# Altium project Arduino - FPGA Development Board.PrjPcb (part 1 of 2)
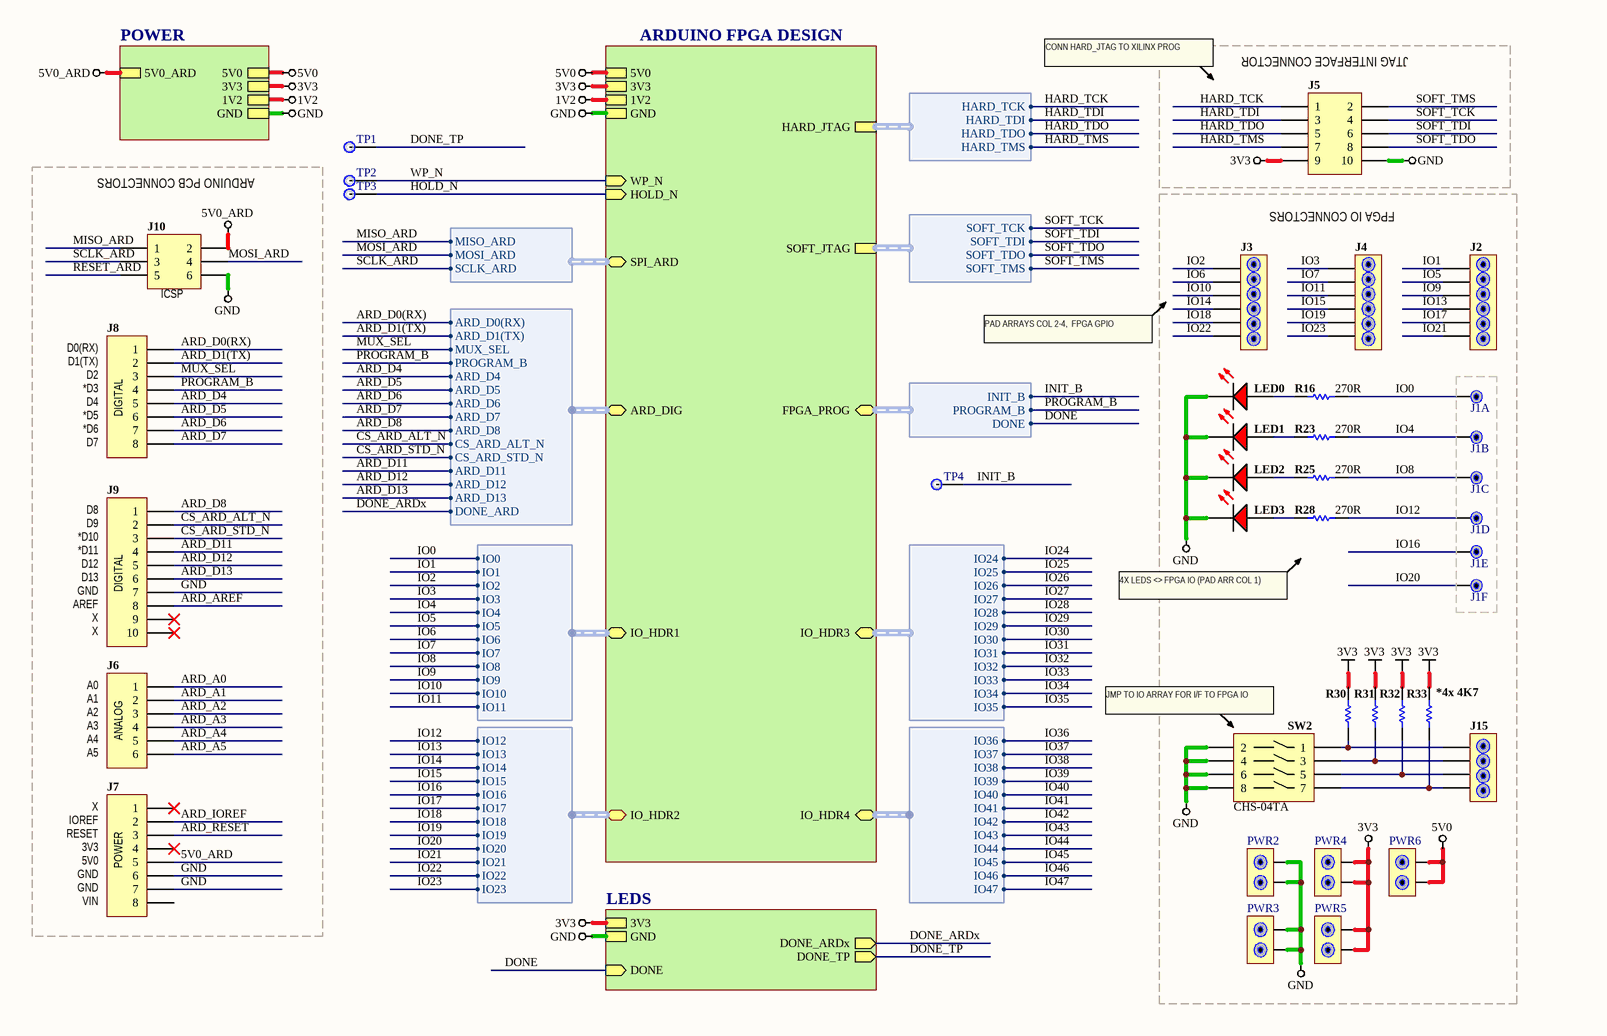
[diagram p0: Arduino FPGA Top-Level Interface.SchDoc]
12 sheets, 121 parts. Net scope: hierarchical (ports join the sheet entries above them; power ports are global).
Board file: Arduino_FPGA_Shield.PcbDoc
Sheets:
  Arduino FPGA Top-Level Interface.SchDoc
    ARDUINO FPGA DESIGN = Arduino FPGA Design.SchDoc
      FLASH_MEMORY = Flash - S25FL216K0PMFI041.SchDoc
      FPGA_SUBSYSTEM = FPGA - XC6SLX9-2TQG144C.schdoc
        U_FPGA - Decoupling = FPGA - Decoupling.SchDoc
      SPI MUX = Arduino FPGA SPI MUX.SchDoc
      SRAM0 = SRAM0 - IS61WV12816DBLL-10BLI.SchDoc
      LEVEL_XSLATE = Arduino FPGA Level Translation.SchDoc
    POWER = Power - 5V0.SchDoc
      Power - 3V3 = Power - 3V3.SchDoc
      Power - 1V2 = Power - 1V2.SchDoc
    LEDS = LEDS - Status.SchDoc

## Sheet Arduino FPGA Top-Level Interface.SchDoc
size A4

### Parts
J1  HDR1X6X1  [HDR1X6]  (value not drawn)  (parts A,B,C,D,E,F of 6)
J2  6-POS VERTICAL HEADER  [HDR1X6]  (value not drawn)
J3  6-POS VERTICAL HEADER  [HDR1X6]  (value not drawn)
J4  6-POS VERTICAL HEADER  [HDR1X6]  (value not drawn)
J5  Header 5X2  [HDR2X5]  (value not drawn)
J6  Header 6  [1X06]  (value not drawn)
J7  Header 8  [1X08]  (value not drawn)
J8  Header 8  [1X08]  (value not drawn)
J9  Header 10  [1X10@1]  (value not drawn)
J10  Header 3X2  [2X03]  (value not drawn)
J15  4-POS VERTICAL HEADER  [HDR1X4]  (value not drawn)
LED0  0402-LED-RED  [LED_0402]  (value not drawn)
LED1  0402-LED-RED  [LED_0402]  (value not drawn)
LED2  0402-LED-RED  [LED_0402]  (value not drawn)
LED3  0402-LED-RED  [LED_0402]  (value not drawn)
PWR2  Jumper  [JMP1X2]  (value not drawn)
PWR3  Jumper  [JMP1X2]  (value not drawn)
PWR4  Jumper  [JMP1X2]  (value not drawn)
PWR5  Jumper  [JMP1X2]  (value not drawn)
PWR6  Jumper  [JMP1X2]  (value not drawn)
R16  value 270R  [RESC0402(1005)40_L]  (hidden comment: 270R 1 0402)
R23  value 270R  [RESC0402(1005)40_L]  (hidden comment: 270R 1 0402)
R25  value 270R  [RESC0402(1005)40_L]  (hidden comment: 270R 1 0402)
R28  value 270R  [RESC0402(1005)40_L]  (hidden comment: 270R 1 0402)
R30  4K7 1 0402  [RESC0402(1005)40_L]  (value not drawn)
R31  4K7 1 0402  [RESC0402(1005)40_L]  (value not drawn)
R32  4K7 1 0402  [RESC0402(1005)40_L]  (value not drawn)
R33  4K7 1 0402  [RESC0402(1005)40_L]  (value not drawn)
SW2  CHS-04TA  [CHS-04A1]
TP1  TESTPOINT_TH  [TESTPOINT_TH]  (value not drawn)
TP2  TESTPOINT_TH  [TESTPOINT_TH]  (value not drawn)
TP3  TESTPOINT_TH  [TESTPOINT_TH]  (value not drawn)
TP4  TESTPOINT_TH  [TESTPOINT_TH]  (value not drawn)

### Blocks framed on the sheet
JTAG INTERFACE CONNECTOR: J5
ARDUINO PCB CONNECTORS: J6-J10
FPGA IO CONNECTORS: J1-J4 J15 LED0-LED3 PWR2-PWR6 R16 R23 R25 R28 R30-R33 SW2

### Sub-sheets
ARDUINO FPGA DESIGN = Arduino FPGA Design.SchDoc: 3V3, GND, 1V2, HARD_JTAG (harness HARD_JTAG), SOFT_JTAG (harness SOFT_JTAG), WP_N (in), HOLD_N (in), IO_HDR2 (harness IO_HDR2), IO_HDR3 (harness IO_HDR3), IO_HDR4 (harness IO_HDR4), IO_HDR1 (harness IO_HDR1), FPGA_PROG (harness FPGA_PROGRAM), SPI_ARD (harness SPI_ARD), 5V0, ARD_DIG (harness ARD_DIG)
LEDS = LEDS - Status.SchDoc: GND, DONE (in), DONE_ARDx (out), DONE_TP (out), 3V3
POWER = Power - 5V0.SchDoc: 5V0, 3V3, 1V2, GND, 5V0_ARD

### Harnesses
HARD_JTAG: HARD_TCK, HARD_TDI, HARD_TDO, HARD_TMS
SOFT_JTAG: SOFT_TCK, SOFT_TDI, SOFT_TDO, SOFT_TMS
FPGA_PROGRAM: INIT_B, PROGRAM_B, DONE
SPI_ARD: MISO_ARD, MOSI_ARD, SCLK_ARD
IO_HDR1: IO0, IO1, IO2, IO3, IO4, IO5, IO6, IO7, IO8, IO9, IO10, IO11
IO_HDR3: IO24, IO25, IO26, IO27, IO28, IO29, IO30, IO31, IO32, IO33, IO34, IO35
IO_HDR4: IO36, IO37, IO38, IO39, IO40, IO41, IO42, IO43, IO44, IO45, IO46, IO47
IO_HDR2: IO12, IO13, IO16, IO17, IO18, IO19, IO20, IO21, IO22, IO23, IO14, IO15
ARD_DIG: ARD_D0(RX), ARD_D1(TX), MUX_SEL, PROGRAM_B, ARD_D4, ARD_D5, ARD_D6, ARD_D7, ARD_D8, CS_ARD_ALT_N, CS_ARD_STD_N, ARD_D11, ARD_D12, ARD_D13, DONE_ARD

### Nets
1V2: sheet ARDUINO FPGA DESIGN/1V2, sheet POWER/1V2
3V3: J5.9 PWR4.1 PWR4.2 PWR5.1 PWR5.2 R30.2 R31.2 R32.2 R33.2 ; sheet ARDUINO FPGA DESIGN/3V3, sheet POWER/3V3, sheet LEDS/3V3
5V0: PWR6.1 PWR6.2 ; sheet ARDUINO FPGA DESIGN/5V0, sheet POWER/5V0
5V0_ARD: J7.5 ; sheet POWER/5V0_ARD
GND: J5.10 J7.6 J7.7 J9.7 J10.6 LED0.2(K) LED1.2(K) LED2.2(K) LED3.2(K) PWR2.1 PWR2.2 PWR3.1 PWR3.2 SW2.2 SW2.4 SW2.6 SW2.8 ; sheet ARDUINO FPGA DESIGN/GND, sheet POWER/GND, sheet LEDS/GND
ARD_A0: J6.1
ARD_A1: J6.2
ARD_A2: J6.3
ARD_A3: J6.4
ARD_A4: J6.5
ARD_A5: J6.6
ARD_AREF: J9.8
ARD_D0(RX): J8.1 ; sheet ARDUINO FPGA DESIGN/ARD_DIG.ARD_D0(RX)
ARD_D1(TX): J8.2 ; sheet ARDUINO FPGA DESIGN/ARD_DIG.ARD_D1(TX)
ARD_D4: J8.5 ; sheet ARDUINO FPGA DESIGN/ARD_DIG.ARD_D4
ARD_D5: J8.6 ; sheet ARDUINO FPGA DESIGN/ARD_DIG.ARD_D5
ARD_D6: J8.7 ; sheet ARDUINO FPGA DESIGN/ARD_DIG.ARD_D6
ARD_D7: J8.8 ; sheet ARDUINO FPGA DESIGN/ARD_DIG.ARD_D7
ARD_D8: J9.1 ; sheet ARDUINO FPGA DESIGN/ARD_DIG.ARD_D8
ARD_D11: J9.4 ; sheet ARDUINO FPGA DESIGN/ARD_DIG.ARD_D11
ARD_D12: J9.5 ; sheet ARDUINO FPGA DESIGN/ARD_DIG.ARD_D12
ARD_D13: J9.6 ; sheet ARDUINO FPGA DESIGN/ARD_DIG.ARD_D13
ARD_IOREF: J7.2
ARD_RESET: J7.3
CS_ARD_ALT_N: J9.2 ; sheet ARDUINO FPGA DESIGN/ARD_DIG.CS_ARD_ALT_N
CS_ARD_STD_N: J9.3 ; sheet ARDUINO FPGA DESIGN/ARD_DIG.CS_ARD_STD_N
DONE: sheet LEDS/DONE, sheet ARDUINO FPGA DESIGN/FPGA_PROG.DONE
DONE_ARDx: sheet LEDS/DONE_ARDx, sheet ARDUINO FPGA DESIGN/ARD_DIG.DONE_ARD
DONE_TP: TP1.1 ; sheet LEDS/DONE_TP
HARD_TCK: J5.1 ; sheet ARDUINO FPGA DESIGN/HARD_JTAG.HARD_TCK
HARD_TDI: J5.3 ; sheet ARDUINO FPGA DESIGN/HARD_JTAG.HARD_TDI
HARD_TDO: J5.5 ; sheet ARDUINO FPGA DESIGN/HARD_JTAG.HARD_TDO
HARD_TMS: J5.7 ; sheet ARDUINO FPGA DESIGN/HARD_JTAG.HARD_TMS
HOLD_N: TP3.1 ; sheet ARDUINO FPGA DESIGN/HOLD_N
INIT_B: TP4.1 ; sheet ARDUINO FPGA DESIGN/FPGA_PROG.INIT_B
IO0: J1.1 R16.2 ; sheet ARDUINO FPGA DESIGN/IO_HDR1.IO0
IO1: J2.1 ; sheet ARDUINO FPGA DESIGN/IO_HDR1.IO1
IO2: J3.1 ; sheet ARDUINO FPGA DESIGN/IO_HDR1.IO2
IO3: J4.1 ; sheet ARDUINO FPGA DESIGN/IO_HDR1.IO3
IO4: J1.2 R23.2 ; sheet ARDUINO FPGA DESIGN/IO_HDR1.IO4
IO5: J2.2 ; sheet ARDUINO FPGA DESIGN/IO_HDR1.IO5
IO6: J3.2 ; sheet ARDUINO FPGA DESIGN/IO_HDR1.IO6
IO7: J4.2 ; sheet ARDUINO FPGA DESIGN/IO_HDR1.IO7
IO8: J1.3 R25.2 ; sheet ARDUINO FPGA DESIGN/IO_HDR1.IO8
IO9: J2.3 ; sheet ARDUINO FPGA DESIGN/IO_HDR1.IO9
IO10: J3.3 ; sheet ARDUINO FPGA DESIGN/IO_HDR1.IO10
IO11: J4.3 ; sheet ARDUINO FPGA DESIGN/IO_HDR1.IO11
IO12: J1.4 R28.2 ; sheet ARDUINO FPGA DESIGN/IO_HDR2.IO12
IO13: J2.4 ; sheet ARDUINO FPGA DESIGN/IO_HDR2.IO13
IO14: J3.4 ; sheet ARDUINO FPGA DESIGN/IO_HDR2.IO14
IO15: J4.4 ; sheet ARDUINO FPGA DESIGN/IO_HDR2.IO15
IO16: J1.5 ; sheet ARDUINO FPGA DESIGN/IO_HDR2.IO16
IO17: J2.5 ; sheet ARDUINO FPGA DESIGN/IO_HDR2.IO17
IO18: J3.5 ; sheet ARDUINO FPGA DESIGN/IO_HDR2.IO18
IO19: J4.5 ; sheet ARDUINO FPGA DESIGN/IO_HDR2.IO19
IO20: J1.6 ; sheet ARDUINO FPGA DESIGN/IO_HDR2.IO20
IO21: J2.6 ; sheet ARDUINO FPGA DESIGN/IO_HDR2.IO21
IO22: J3.6 ; sheet ARDUINO FPGA DESIGN/IO_HDR2.IO22
IO23: J4.6 ; sheet ARDUINO FPGA DESIGN/IO_HDR2.IO23
IO31: sheet ARDUINO FPGA DESIGN/IO_HDR3.IO31
IO32: sheet ARDUINO FPGA DESIGN/IO_HDR3.IO32
IO33: sheet ARDUINO FPGA DESIGN/IO_HDR3.IO33
IO34: sheet ARDUINO FPGA DESIGN/IO_HDR3.IO34
IO35: sheet ARDUINO FPGA DESIGN/IO_HDR3.IO35
IO36: sheet ARDUINO FPGA DESIGN/IO_HDR4.IO36
IO37: sheet ARDUINO FPGA DESIGN/IO_HDR4.IO37
IO38: sheet ARDUINO FPGA DESIGN/IO_HDR4.IO38
IO39: sheet ARDUINO FPGA DESIGN/IO_HDR4.IO39
IO40: sheet ARDUINO FPGA DESIGN/IO_HDR4.IO40
IO41: sheet ARDUINO FPGA DESIGN/IO_HDR4.IO41
IO42: sheet ARDUINO FPGA DESIGN/IO_HDR4.IO42
IO43: sheet ARDUINO FPGA DESIGN/IO_HDR4.IO43
IO44: sheet ARDUINO FPGA DESIGN/IO_HDR4.IO44
IO45: sheet ARDUINO FPGA DESIGN/IO_HDR4.IO45
IO46: sheet ARDUINO FPGA DESIGN/IO_HDR4.IO46
IO47: sheet ARDUINO FPGA DESIGN/IO_HDR4.IO47
MISO_ARD: J10.1 ; sheet ARDUINO FPGA DESIGN/SPI_ARD.MISO_ARD
MOSI_ARD: J10.4 ; sheet ARDUINO FPGA DESIGN/SPI_ARD.MOSI_ARD
MUX_SEL: J8.3 ; sheet ARDUINO FPGA DESIGN/ARD_DIG.MUX_SEL
PROGRAM_B: J8.4 ; sheet ARDUINO FPGA DESIGN/FPGA_PROG.PROGRAM_B, sheet ARDUINO FPGA DESIGN/ARD_DIG.PROGRAM_B
RESET_ARD: J10.5
SCLK_ARD: J10.3 ; sheet ARDUINO FPGA DESIGN/SPI_ARD.SCLK_ARD
SOFT_TCK: J5.4 ; sheet ARDUINO FPGA DESIGN/SOFT_JTAG.SOFT_TCK
SOFT_TDI: J5.6 ; sheet ARDUINO FPGA DESIGN/SOFT_JTAG.SOFT_TDI
SOFT_TDO: J5.8 ; sheet ARDUINO FPGA DESIGN/SOFT_JTAG.SOFT_TDO
SOFT_TMS: J5.2 ; sheet ARDUINO FPGA DESIGN/SOFT_JTAG.SOFT_TMS
WP_N: TP2.1 ; sheet ARDUINO FPGA DESIGN/WP_N
NetJ15_1: J15.1 R30.1 SW2.1
NetJ15_2: J15.2 R31.1 SW2.3
NetJ15_3: J15.3 R32.1 SW2.5
NetJ15_4: J15.4 R33.1 SW2.7
NetLED0_1: LED0.1(A) R16.1
NetLED1_1: LED1.1(A) R23.1
NetLED2_1: LED2.1(A) R25.1
NetLED3_1: LED3.1(A) R28.1

Not connected (* = marked no-connect by the designer): J7 1* 4* 8; J9 9* 10*; J10 2

### Notes on the sheet
- CONN HARD_JTAG TO XILINX PROG
- (near J10) ICSP
- (near J8) D0(RX)
- (near J8) D1(TX)
- (near J8) D2
- PAD ARRAYS COL 2-4,  FPGA GPIO
- (near J8) *D3
- (near J8) D4
- (near J8) *D5
- (near J8) *D6
- (near J8) D7
- (near J8) DIGITAL
- (near J9) D8
- (near J9) D9
- (near J9) *D10
- (near J9) *D11
- (near J9) D12
- (near J9) D13
- (near J9) GND
- (near J9) AREF
- (near J9) X
- X
- (near J9) DIGITAL
- 4X LEDS <> FPGA IO (PAD ARR COL 1)
- A0
- (near J6) A1
- (near J6) A2
- (near SW2) JMP TO IO ARRAY FOR I/F TO FPGA IO
- (near R33) *4x 4K7
- (near J6) A3
- (near J6) A4
- A5
- (near J6) ANALOG
- (near J7) IOREF
- (near J7) RESET
- (near J7) 3V3
- (near J7) 5V0
- (near J7) GND
- (near J7) VIN
- (near J7) POWER
- Labels drawn without touching a wire or pin: 5V0_ARD

### Library data of the parts
J1 = HDR1X6X1: Manufacturer_PN: 68000-406HLF; Manufacturer Part Number: 68000-406HLF
J2-J4 = 6-POS-HDR: Manufacturer_PN: 68000-406HLF; Manufacturer Part Number: 68000-406HLF
J5 = Header 5X2: Header, 5-Pin, Dual row; Manufacturer_PN: 67997-210HLF; LatestRevisionDate: 17-Jul-2002; LatestRevisionNote: Re-released for DXP Platform.; Publisher: Altium Limited; Manufacturer Part Number: 67997-210HLF
J6 = Header 6: Header, 6-Pin; Manufacturer_PN: DNP; LatestRevisionDate: 17-Jul-2002; LatestRevisionNote: Re-released for DXP Platform.; Publisher: Altium Limited; Manufacturer Part Number: DNP
J7 J8 = Header 8: Header, 8-Pin; Manufacturer_PN: DNP; LatestRevisionDate: 17-Jul-2002; LatestRevisionNote: Re-released for DXP Platform.; Publisher: Altium Limited; Manufacturer Part Number: DNP
J9 = Header 10: Header, 10-Pin; Manufacturer_PN: DNP; LatestRevisionDate: 17-Jul-2002; LatestRevisionNote: Re-released for DXP Platform.; Publisher: Altium Limited; Manufacturer Part Number: DNP
J10 = Header 3X2: Header, 3-Pin, Dual row; Manufacturer_PN: DNP; LatestRevisionDate: 17-Jul-2002; LatestRevisionNote: Re-released for DXP Platform.; Publisher: Altium Limited; Manufacturer Part Number: DNP
J15 = 4-POS-HDR: Manufacturer_PN: 68000-404HLF; Manufacturer Part Number: 68000-404HLF
LED0-LED3 = CMP-0201-0013: 0402 LED,RED; Manufacturer_PN: LTST-C190KRKT; DefaultDesignator: LED?; Class: Diodes; Current Average (Io): 1.8V; ID: CMP-0201-0013; Sub Class: LED; Reverse Voltage DC (Vr): Red; ComponentLink1Description: Datasheet; ComponentLink1URL: http://optoelectronics.liteon.com/upload/download/DS-22-99-0151/S_110_LTST-C190KRKT.pdf; ComponentLink2Description: Manufacturer; ComponentLink2URL: http://www.liteon.com; Manufacturer Part Number: LTST-C190KRKT
PWR2-PWR6 = JMP1X2: Standard 2 Pin Jumper, 100mil spacing; Manufacturer_PN: M20-9770246; Manufacturer Part Number: M20-9770246
R16 R23 R25 R28 = CMP-0503-0059: 0402 (1005 Metric) 1/16 W 270R 1 Thick Film Chip Resistor; Manufacturer_PN: RC1005F271CS; Case-EIA: 0402; Case-Metric: 1005; Temp Coefficient ppm/°C: ±100; Tolerance %: 1%; Value (Ohms): 270; Power: 1/16 W; ID: CMP-0503-0059; Technology: SMT; Manufacturer Part Number: RC1005F271CS
R30-R33 = 0402 (1005 Metric) 1/16 W 4K7 1 Thick Film Chip Resistor: Manufacturer_PN: CR0402-FX-4701GLFDKR-ND; Case-EIA: 0402; Case-Metric: 1005; Power: 1/16 W; Temp Coefficient ppm/°C: ±100; Tolerance %: 1%; Value (Ohms): 4700; Value: 4K7; Technology: SMT; Manufacturer Part Number: CR0402-FX-4701GLFDKR-ND
SW2 = CHS-04TA: SWITCH DIP 4-POS SLIDE SMD 6V; Manufacturer: Copal Electronics Inc; Circuit: SPST; Number of Positions: 4; Contact Rating @ Voltage: 0.1A @ 6VDC; Actuator Type: Standard; Actuator Level: Flush; Washable: Yes; Supplier 1: Digi-Key; Manufacturer Part Number: CHS-04TA; RoHS: RoHS Compliant; Category: Switches; Stock 1: 2000; Pricing 1: 500=1.33876, 1000=1.1475, 5000=1.05188 (USD); Mounting Type: Surface Mount; Orientation: Top Actuated; ComponentLink1URL: http://copal-electronics.info/en/0008e/0267f.pdf; ComponentLink1Description: http://copal-electronics.info/en/0008e/0267f.pdf; Supplier Part Number 1: 563-1007-2-ND; Manufacturer_PN: CHS-04TA
TP1-TP4 = TESTPOINT_TH: Manufacturer_PN: TESTPOINT; Manufacturer Part Number: TESTPOINT

## Sheet Arduino FPGA Design.SchDoc
size A4
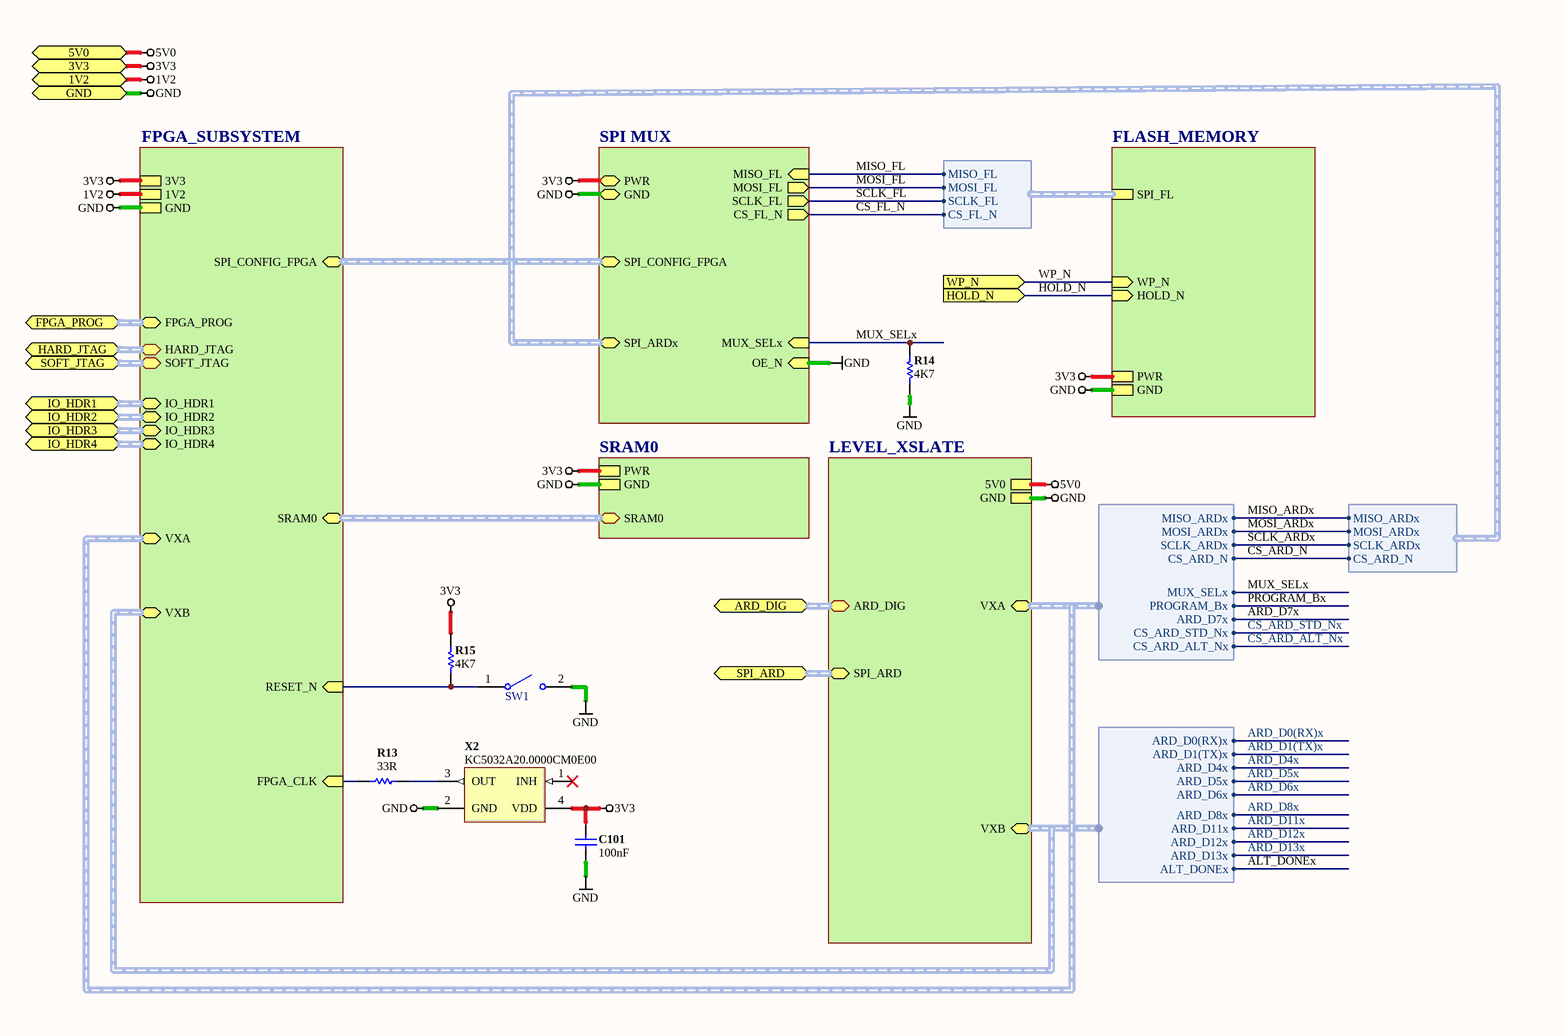
[diagram p1: Arduino FPGA Design.SchDoc]

### Parts
C101  value 100nF  [CAPC0402(1005)60_L]  (hidden comment: CAP 100nF 16V 0402(1005))
R13  value 33R  [RESC0402(1005)40_L]  (hidden comment: 33R 1 0402)
R14  value 4K7  [RESC0402(1005)40_L]  (hidden comment: 4K7 1 0402)
R15  value 4K7  [RESC0402(1005)40_L]  (hidden comment: 4K7 1 0402)
SW1  ADTSM32RVTR  [ADTSM32RVTR]  (value not drawn)
X2  KC5032A20.0000CM0E00  [HOSC-L500HW320H105-4_2]

### Sub-sheets
FLASH_MEMORY = Flash - S25FL216K0PMFI041.SchDoc: SPI_FL (harness SPI_FLASH), PWR, WP_N (in), HOLD_N (in), GND
FPGA_SUBSYSTEM = FPGA - XC6SLX9-2TQG144C.schdoc: 3V3, GND, 1V2, FPGA_CLK (in), HARD_JTAG (harness HARD_JTAG), SOFT_JTAG (harness SOFT_JTAG), IO_HDR3 (harness IO_HDR3), IO_HDR4 (harness IO_HDR4), SPI_CONFIG_FPGA (harness SPI_CONFIG_FPGA), FPGA_PROG (harness FPGA_PROGRAM), IO_HDR1 (harness IO_HDR1), IO_HDR2 (harness IO_HDR2), SRAM0 (harness SRAM0), RESET_N (in), VXA (harness VXA), VXB (harness VXB)
LEVEL_XSLATE = Arduino FPGA Level Translation.SchDoc: GND, 5V0, ARD_DIG (harness ARD_DIG), SPI_ARD (harness SPI_ARD), VXA (harness VXA), VXB (harness VXB)
SPI MUX = Arduino FPGA SPI MUX.SchDoc: MISO_FL (in), MOSI_FL (out), SCLK_FL (out), CS_FL_N (out), OE_N (in), MUX_SELx (in), SPI_CONFIG_FPGA (harness SPI_CONFIG_FPGA), PWR, GND, SPI_ARDx (harness SPI_ARDx)
SRAM0 = SRAM0 - IS61WV12816DBLL-10BLI.SchDoc: PWR, GND, SRAM0 (harness SRAM0)

### Ports
1V2, 3V3, 5V0, ARD_DIG (harness ARD_DIG), FPGA_PROG (harness FPGA_PROGRAM), GND, HARD_JTAG (harness HARD_JTAG), HOLD_N (in), IO_HDR1 (harness IO_HDR1), IO_HDR2 (harness IO_HDR2), IO_HDR3 (harness IO_HDR3), IO_HDR4 (harness IO_HDR4), SOFT_JTAG (harness SOFT_JTAG), SPI_ARD (harness SPI_ARD), WP_N (in)

### Harnesses
SPI_FLASH: MOSI_FL, MISO_FL, SCLK_FL, CS_FL_N
VXB: ARD_D0(RX)x, ARD_D1(TX)x, ARD_D4x, ARD_D5x, ARD_D6x, ARD_D8x, ARD_D11x, ARD_D12x, ARD_D13x, ALT_DONEx
SPI_ARDx: MISO_ARDx, MOSI_ARDx, SCLK_ARDx, CS_ARD_N
VXA: MISO_ARDx, MOSI_ARDx, SCLK_ARDx, CS_ARD_N, MUX_SELx, PROGRAM_Bx, ARD_D7x, CS_ARD_STD_Nx, CS_ARD_ALT_Nx

### Nets
1V2: port 1V2, sheet FPGA_SUBSYSTEM/1V2
3V3: C101.1 R15.2 X2.4(VDD) ; port 3V3, sheet FLASH_MEMORY/PWR, sheet FPGA_SUBSYSTEM/3V3, sheet SPI MUX/PWR, sheet SRAM0/PWR
5V0: port 5V0, sheet LEVEL_XSLATE/5V0
GND: C101.2 R14.1 SW1.2 X2.2(GND) ; port GND, sheet FLASH_MEMORY/GND, sheet FPGA_SUBSYSTEM/GND, sheet SPI MUX/OE_N, sheet SPI MUX/GND, sheet SRAM0/GND, sheet LEVEL_XSLATE/GND
CS_ARD_N: sheet SPI MUX/SPI_ARDx.CS_ARD_N, sheet FPGA_SUBSYSTEM/VXA.CS_ARD_N
CS_FL_N: sheet SPI MUX/CS_FL_N, sheet FLASH_MEMORY/SPI_FL.CS_FL_N
FPGA_CLK: R13.1 ; sheet FPGA_SUBSYSTEM/FPGA_CLK
HOLD_N: port HOLD_N, sheet FLASH_MEMORY/HOLD_N
MISO_ARDx: sheet SPI MUX/SPI_ARDx.MISO_ARDx, sheet FPGA_SUBSYSTEM/VXA.MISO_ARDx
MISO_FL: sheet SPI MUX/MISO_FL, sheet FLASH_MEMORY/SPI_FL.MISO_FL
MOSI_ARDx: sheet SPI MUX/SPI_ARDx.MOSI_ARDx, sheet FPGA_SUBSYSTEM/VXA.MOSI_ARDx
MOSI_FL: sheet SPI MUX/MOSI_FL, sheet FLASH_MEMORY/SPI_FL.MOSI_FL
MUX_SELx: R14.2 ; sheet SPI MUX/MUX_SELx, sheet FPGA_SUBSYSTEM/VXA.MUX_SELx
RESET_N: R15.1 SW1.1 ; sheet FPGA_SUBSYSTEM/RESET_N
SCLK_ARDx: sheet SPI MUX/SPI_ARDx.SCLK_ARDx, sheet FPGA_SUBSYSTEM/VXA.SCLK_ARDx
SCLK_FL: sheet SPI MUX/SCLK_FL, sheet FLASH_MEMORY/SPI_FL.SCLK_FL
WP_N: port WP_N, sheet FLASH_MEMORY/WP_N
NetR13_2: R13.2 X2.3(OUT)

Not connected (* = marked no-connect by the designer): X2 1(INH)*

### Buses and harness runs
harness port ARD_DIG = sheet LEVEL_XSLATE/ARD_DIG
harness port FPGA_PROG = sheet FPGA_SUBSYSTEM/FPGA_PROG
harness port HARD_JTAG = sheet FPGA_SUBSYSTEM/HARD_JTAG
harness port IO_HDR1 = sheet FPGA_SUBSYSTEM/IO_HDR1
harness port IO_HDR2 = sheet FPGA_SUBSYSTEM/IO_HDR2
harness port IO_HDR3 = sheet FPGA_SUBSYSTEM/IO_HDR3
harness port IO_HDR4 = sheet FPGA_SUBSYSTEM/IO_HDR4
harness port SOFT_JTAG = sheet FPGA_SUBSYSTEM/SOFT_JTAG
harness port SPI_ARD = sheet LEVEL_XSLATE/SPI_ARD
harness sheet FPGA_SUBSYSTEM/SPI_CONFIG_FPGA = sheet SPI MUX/SPI_CONFIG_FPGA
harness sheet FPGA_SUBSYSTEM/SRAM0 = sheet SRAM0/SRAM0
harness sheet FPGA_SUBSYSTEM/VXA = sheet LEVEL_XSLATE/VXA
harness sheet FPGA_SUBSYSTEM/VXB = sheet LEVEL_XSLATE/VXB

### Library data of the parts
C101 = CAP 100nF 16V ±10% 0402 (1005 Metric) Thickness 0.6mm SMD: Manufacturer_PN: C0402C104K8PACTU; Case-EIA: 0402; Case-Metric: 1005; Tolerance: ±10%; Max Thickness: 0.6 mm; Rated Voltage: 16 V; Technology: SMT; Manufacturer Part Number: C0402C104K8PACTU
R13 = 0402 (1005 Metric) 1/16 W 33R 1 Thick Film Chip Resistor: Manufacturer_PN: RC1005F330CS; Case-EIA: 0402; Case-Metric: 1005; Temp Coefficient ppm/°C: ±100; Tolerance %: 1%; Value (Ohms): 33; Power: 1/16 W; Technology: SMT; Manufacturer Part Number: RC1005F330CS
R14 R15 = 0402 (1005 Metric) 1/16 W 4K7 1 Thick Film Chip Resistor: as R30 on sheet Arduino FPGA Top-Level Interface; Technology: SMT; Manufacturer Part Number: CR0402-FX-4701GLFDKR-ND
SW1 = ADTSM32RVTR: ADTSM32RVTR SWITCH, TACTILE, SPST-NO, 50mA, 12VDC SMD; Manufacturer: APEM; ID: CMP-0800-0004; DefaultDesignator: SW?; Class: Button; Manufacturer_PN: ADTSM32RVTR; ComponentLink1Description: Datasheet; ComponentLink2Description: Manufacturer; Manufacturer Part Number: ADTSM32RVTR
X2 = OSCILLATOR 20.0000MHZ SMD: PartNumber: HCX-C2-20M; DefaultDesignator: X?; Class: Oscillators; Frequency: 20.00 MHZ; Output: CMOS; Supply Voltage: 3V3, 5V0; ComponentLink1Description: Datasheet; ComponentLink1URL: http://www.hongkongcrystal.com/upload/product/original/347881837473.pdf; ComponentLink2Description: Manufacturer; ComponentLink2URL: http://global.kyocera.com/; Type: XO (Standard); Manufacturer_PN: KC5032A20.0000CM0E00; Manufacturer Part Number: KC5032A20.0000CM0E00

## Sheet Flash - S25FL216K0PMFI041.SchDoc
size A4; minSupply: 2V4; maxSupply: 3V7
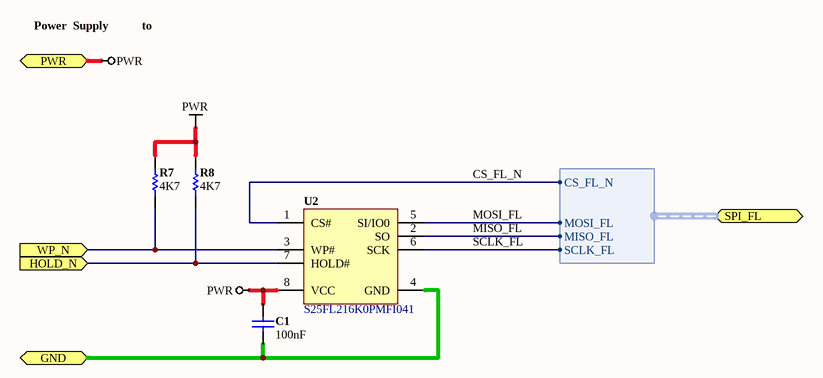
[diagram p2: Flash - S25FL216K0PMFI041.SchDoc]

### Parts
C1  value 100nF  [CAPC0402(1005)60_L]  (hidden comment: CAP 100nF 16V 0402(1005))
R7  4K7  [RESC0402(1005)40_L]
R8  4K7  [RESC0402(1005)40_L]
U2  S25FL216K0PMFI041  [SPANSION-SOIC127P600X175-8M]

### Ports
GND, HOLD_N (in), PWR, SPI_FL (harness SPI_FLASH), WP_N (in)

### Harnesses
SPI_FLASH: MOSI_FL, MISO_FL, SCLK_FL, CS_FL_N

### Nets
GND: C1.2 U2.4(GND) ; port GND
PWR: C1.1 R7.2 R8.2 U2.8(VCC) ; port PWR  [project net 3V3]
CS_FL_N: U2.1(CS#) ; port SPI_FL.CS_FL_N
HOLD_N: R8.1 U2.7(HOLD#) ; port HOLD_N
MISO_FL: U2.2(SO) ; port SPI_FL.MISO_FL
MOSI_FL: U2.5(SI/IO0) ; port SPI_FL.MOSI_FL
SCLK_FL: U2.6(SCK) ; port SPI_FL.SCLK_FL
WP_N: R7.1 U2.3(WP#) ; port WP_N

### Notes on the sheet
- Power  Supply
- to

### Library data of the parts
C1 = CAP 100nF 16V ±10% 0402 (1005 Metric) Thickness 0.6mm SMD: as C101 on sheet Arduino FPGA Design; Max Thickness: 0.6 mm; Rated Voltage: 16 V; Technology: SMT; Manufacturer Part Number: C0402C104K8PACTU
R7 R8 = 0402 (1005 Metric) 1/16 W 4K7 1 Thick Film Chip Resistor: Manufacturer_PN: CR0402-FX-4701GLFDKR-ND; Case-EIA: 0402; Case-Metric: 1005; Temp Coefficient ppm/°C: ±100; Tolerance %: 1%; Value (Ohms): 4700; Power: 1/16 W; Value: 4K7; Technology: SMT; Manufacturer Part Number: CR0402-FX-4701GLFDKR-ND
U2 = S25FL216K0PMFI041: 16-Mbit 3.0V Serial Flash Memory with Uniform 4 kB Sectors; ComponentLink1Description: Locate on FindChips.com; ComponentLink1URL: http://www.findchips.com/search/s25fl216k0pmfi041; Manufacturer Part Number: S25FL216K0PMFI041; ComponentLink2Description: Locate on Datasheet.Net; ComponentLink2URL: http://www.datasheet.net/document/566207/; Manufacturer_PN: S25FL216K0PMFI041

## Sheet FPGA - XC6SLX9-2TQG144C.schdoc
size B
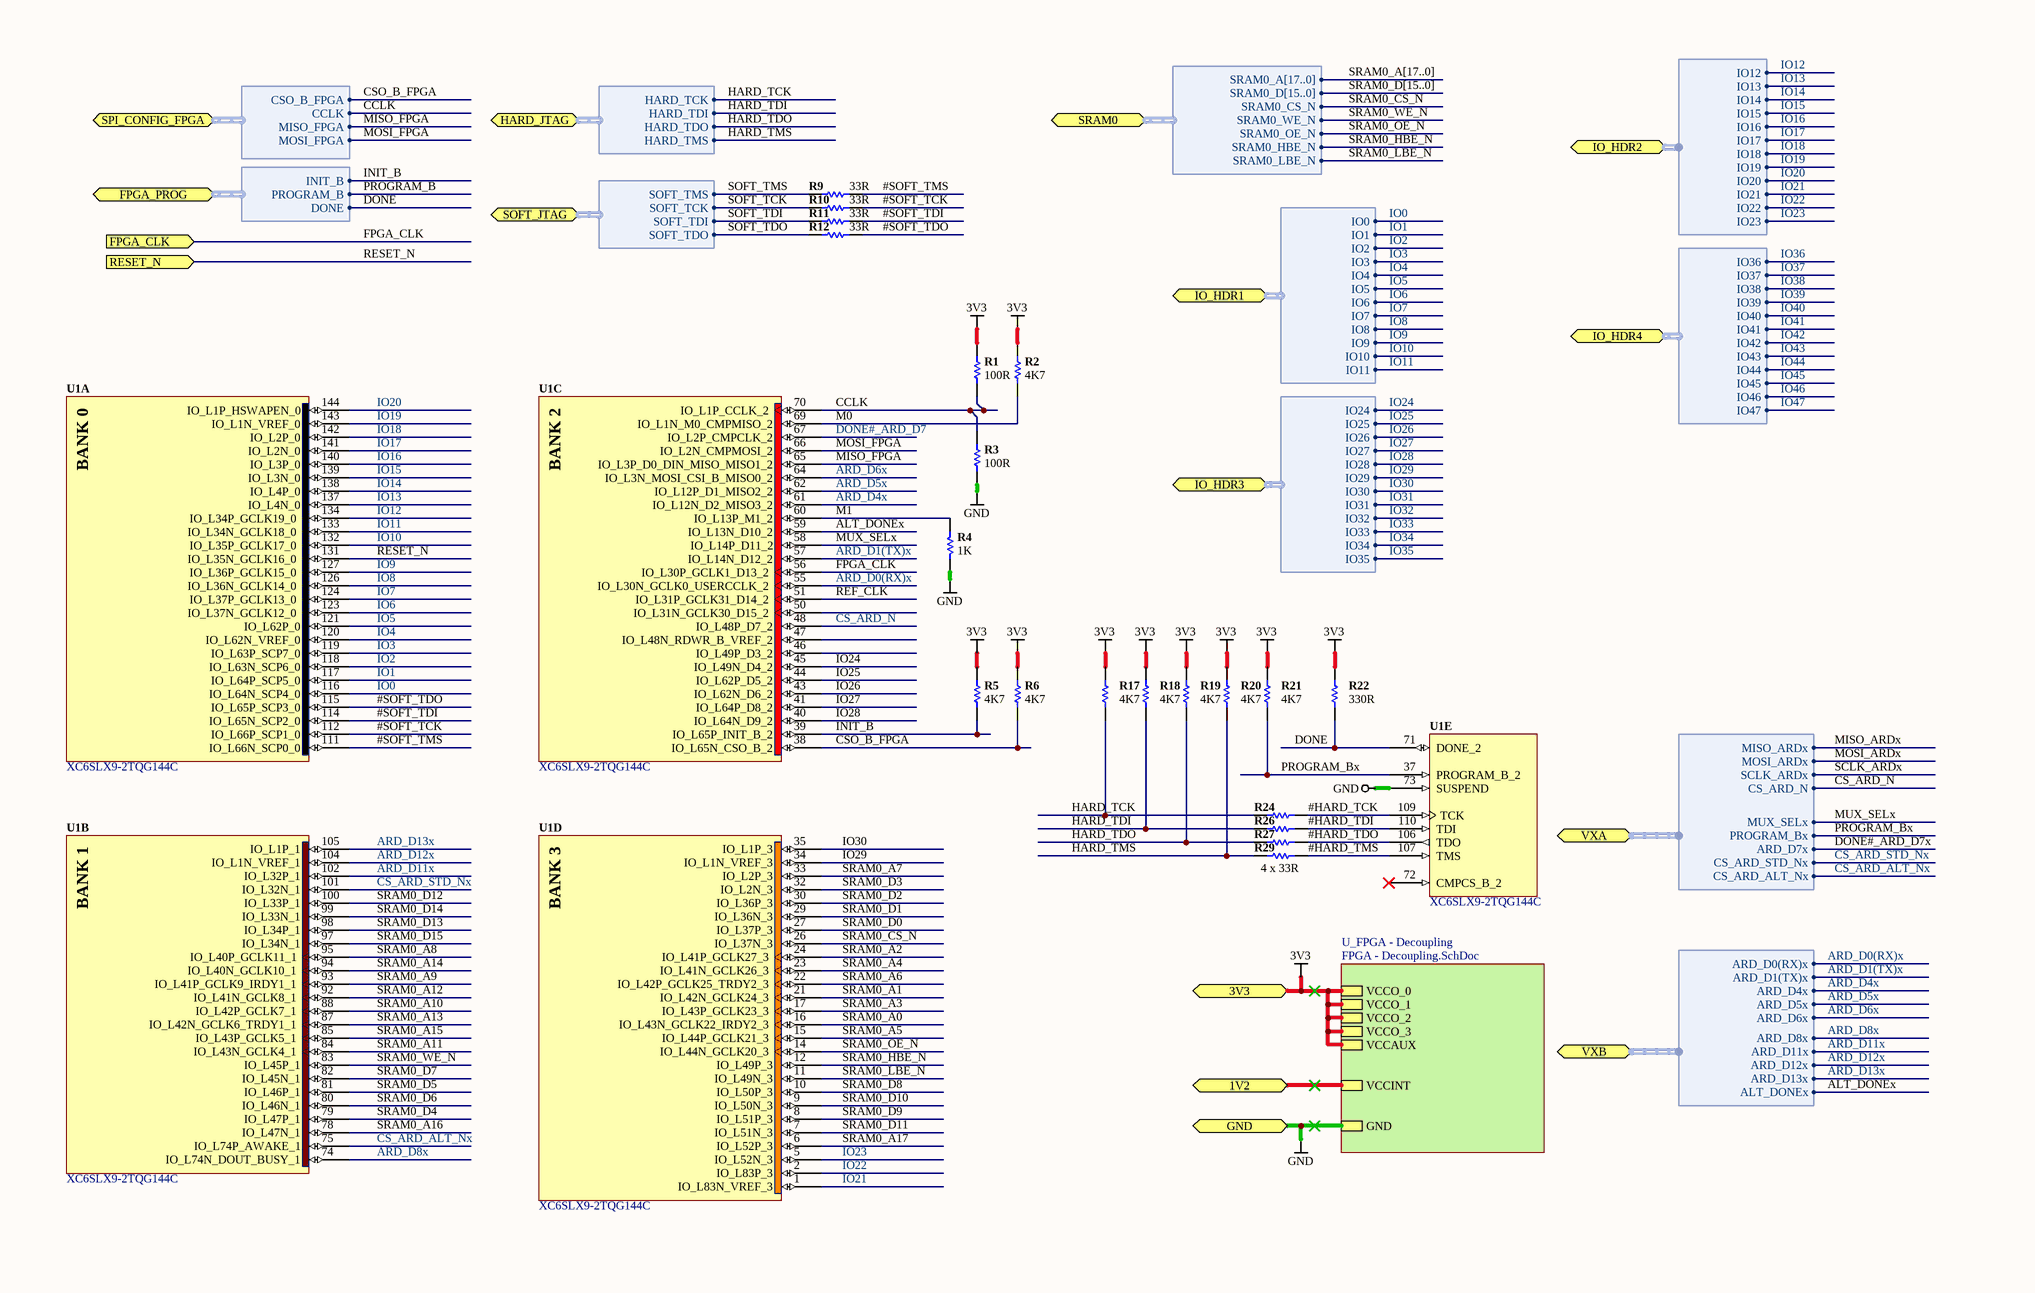
[diagram p3: FPGA - XC6SLX9-2TQG144C.schdoc]

### Parts
(Parts that share a designator on the sheet are numbered #1, #2 ... from top to bottom, then left to right.)
R1  value 100R  [RESC0402(1005)40_L]  (hidden comment: 100R 1 0402)
R2  value 4K7  [RESC0402(1005)40_L]  (hidden comment: 4K7 1 0402)
R3  value 100R  [RESC0402(1005)40_L]  (hidden comment: 100R 1 0402)
R4  value 1K  [RESC0402(1005)40_L]  (hidden comment: 1K 1 0402)
R5  value 4K7  [RESC0402(1005)40_L]  (hidden comment: 4K7 1 0402)
R6  value 4K7  [RESC0402(1005)40_L]  (hidden comment: 4K7 1 0402)
R9  value 33R  [RESC0402(1005)40_L]  (hidden comment: 33R 1 0402)
R10  value 33R  [RESC0402(1005)40_L]  (hidden comment: 33R 1 0402)
R11  value 33R  [RESC0402(1005)40_L]  (hidden comment: 33R 1 0402)
R12  value 33R  [RESC0402(1005)40_L]  (hidden comment: 33R 1 0402)
R17  value 4K7  [RESC0402(1005)40_L]  (hidden comment: 4K7 1 0402)
R18  value 4K7  [RESC0402(1005)40_L]  (hidden comment: 4K7 1 0402)
R19  value 4K7  [RESC0402(1005)40_L]  (hidden comment: 4K7 1 0402)
R20  value 4K7  [RESC0402(1005)40_L]  (hidden comment: 4K7 1 0402)
R21  value 4K7  [RESC0402(1005)40_L]  (hidden comment: 4K7 1 0402)
R22  value 330R  [RESC0402(1005)40_L]  (hidden comment: 330R 1 0402)
R24  33R 1 0402  [RESC0402(1005)40_L]  (value not drawn)
R26  33R 1 0402  [RESC0402(1005)40_L]  (value not drawn)
R27  33R 1 0402  [RESC0402(1005)40_L]  (value not drawn)
R29  33R 1 0402  [RESC0402(1005)40_L]  (value not drawn)
U1#1  XC6SLX9-2TQG144C  [TQG144_N]  (parts A,B,D,E of 7)
U1#2  XC6SLX9-2TQG144C  [TQG144_N]  (part C of 7)

### Sub-sheets
U_FPGA - Decoupling = FPGA - Decoupling.SchDoc: VCCO_0, VCCO_3, VCCO_1, VCCO_2, VCCAUX, VCCINT, GND

### Ports
1V2, 3V3, FPGA_CLK (in), FPGA_PROG (harness FPGA_PROGRAM), GND, HARD_JTAG (harness HARD_JTAG), IO_HDR1 (harness IO_HDR1), IO_HDR2 (harness IO_HDR2), IO_HDR3 (harness IO_HDR3), IO_HDR4 (harness IO_HDR4), RESET_N (in), SOFT_JTAG (harness SOFT_JTAG), SPI_CONFIG_FPGA (harness SPI_CONFIG_FPGA), SRAM0 (harness SRAM0), VXA (harness VXA), VXB (harness VXB)

### Harnesses
SPI_CONFIG_FPGA: CSO_B_FPGA, CCLK, MISO_FPGA, MOSI_FPGA
HARD_JTAG: HARD_TCK, HARD_TDI, HARD_TDO, HARD_TMS
SOFT_JTAG: SOFT_TCK, SOFT_TDI, SOFT_TDO, SOFT_TMS
IO_HDR1: IO0, IO1, IO2, IO3, IO4, IO5, IO6, IO7, IO8, IO9, IO10, IO11
IO_HDR3: IO24, IO25, IO26, IO27, IO28, IO29, IO30, IO31, IO32, IO33, IO34, IO35
IO_HDR4: IO36, IO37, IO38, IO39, IO40, IO41, IO42, IO43, IO44, IO45, IO46, IO47
FPGA_PROGRAM: INIT_B, PROGRAM_B, DONE
IO_HDR2: IO12, IO13, IO16, IO17, IO18, IO19, IO20, IO21, IO22, IO23, IO14, IO15
SRAM0: SRAM0_A[17..0], SRAM0_D[15..0], SRAM0_CS_N, SRAM0_WE_N, SRAM0_OE_N, SRAM0_HBE_N, SRAM0_LBE_N
VXB: ARD_D0(RX)x, ARD_D1(TX)x, ARD_D4x, ARD_D5x, ARD_D6x, ARD_D8x, ARD_D11x, ARD_D12x, ARD_D13x, ALT_DONEx
VXA: MISO_ARDx, MOSI_ARDx, SCLK_ARDx, CS_ARD_N, MUX_SELx, PROGRAM_Bx, ARD_D7x, CS_ARD_STD_Nx, CS_ARD_ALT_Nx

### Nets
1V2: port 1V2, sheet U_FPGA - Decoupling/VCCINT
3V3: R1.2 R2.2 R5.2 R6.2 R17.2 R18.2 R19.2 R20.2 R21.2 R22.2 ; port 3V3, sheet U_FPGA - Decoupling/VCCO_0, sheet U_FPGA - Decoupling/VCCO_3, sheet U_FPGA - Decoupling/VCCO_1, sheet U_FPGA - Decoupling/VCCO_2, sheet U_FPGA - Decoupling/VCCAUX
GND: R3.1 R4.1 U1#1.73(SUSPEND) ; port GND, sheet U_FPGA - Decoupling/GND
#HARD_TCK: R24.2 U1#1.109(TCK)
#HARD_TDI: R26.2 U1#1.110(TDI)
#HARD_TDO: R27.2 U1#1.106(TDO)
#HARD_TMS: R29.2 U1#1.107(TMS)
#SOFT_TCK: R10.2 U1#1.112(IO_L66P_SCP1_0)
#SOFT_TDI: R11.2 U1#1.114(IO_L65N_SCP2_0)
#SOFT_TDO: R12.2 U1#1.115(IO_L65P_SCP3_0)
#SOFT_TMS: R9.2 U1#1.111(IO_L66N_SCP0_0)
ALT_DONEx: U1#2.59(IO_L13N_D10_2) ; port VXB.ALT_DONEx
ARD_D0(RX)x: U1#2.55(IO_L30N_GCLK0_USERCCLK_2) ; port VXB.ARD_D0(RX)x
ARD_D1(TX)x: U1#2.57(IO_L14N_D12_2) ; port VXB.ARD_D1(TX)x
ARD_D4x: U1#2.61(IO_L12N_D2_MISO3_2) ; port VXB.ARD_D4x
ARD_D5x: U1#2.62(IO_L12P_D1_MISO2_2) ; port VXB.ARD_D5x
ARD_D6x: U1#2.64(IO_L3N_MOSI_CSI_B_MISO0_2) ; port VXB.ARD_D6x
ARD_D8x: U1#1.74(IO_L74N_DOUT_BUSY_1) ; port VXB.ARD_D8x
ARD_D11x: U1#1.102(IO_L32P_1) ; port VXB.ARD_D11x
ARD_D12x: U1#1.104(IO_L1N_VREF_1) ; port VXB.ARD_D12x
ARD_D13x: U1#1.105(IO_L1P_1) ; port VXB.ARD_D13x
CCLK: R1.1 R3.2 U1#2.70(IO_L1P_CCLK_2) ; port SPI_CONFIG_FPGA.CCLK
CS_ARD_ALT_Nx: U1#1.75(IO_L74P_AWAKE_1) ; port VXA.CS_ARD_ALT_Nx
CS_ARD_N: U1#2.48(IO_L48P_D7_2) ; port VXA.CS_ARD_N
CS_ARD_STD_Nx: U1#1.101(IO_L32N_1) ; port VXA.CS_ARD_STD_Nx
CSO_B_FPGA: R6.1 U1#2.38(IO_L65N_CSO_B_2) ; port SPI_CONFIG_FPGA.CSO_B_FPGA
DONE: R22.1 U1#1.71(DONE_2) ; port FPGA_PROG.DONE
DONE#_ARD_D7: U1#2.67(IO_L2P_CMPCLK_2)
FPGA_CLK: U1#2.56(IO_L30P_GCLK1_D13_2) ; port FPGA_CLK
HARD_TCK: R17.1 R24.1 ; port HARD_JTAG.HARD_TCK
HARD_TDI: R18.1 R26.1 ; port HARD_JTAG.HARD_TDI
HARD_TDO: R19.1 R27.1 ; port HARD_JTAG.HARD_TDO
HARD_TMS: R20.1 R29.1 ; port HARD_JTAG.HARD_TMS
INIT_B: R5.1 U1#2.39(IO_L65P_INIT_B_2) ; port FPGA_PROG.INIT_B
IO0: U1#1.116(IO_L64N_SCP4_0) ; port IO_HDR1.IO0
IO1: U1#1.117(IO_L64P_SCP5_0) ; port IO_HDR1.IO1
IO2: U1#1.118(IO_L63N_SCP6_0) ; port IO_HDR1.IO2
IO3: U1#1.119(IO_L63P_SCP7_0) ; port IO_HDR1.IO3
IO4: U1#1.120(IO_L62N_VREF_0) ; port IO_HDR1.IO4
IO5: U1#1.121(IO_L62P_0) ; port IO_HDR1.IO5
IO6: U1#1.123(IO_L37N_GCLK12_0) ; port IO_HDR1.IO6
IO7: U1#1.124(IO_L37P_GCLK13_0) ; port IO_HDR1.IO7
IO8: U1#1.126(IO_L36N_GCLK14_0) ; port IO_HDR1.IO8
IO9: U1#1.127(IO_L36P_GCLK15_0) ; port IO_HDR1.IO9
IO10: U1#1.132(IO_L35P_GCLK17_0) ; port IO_HDR1.IO10
IO11: U1#1.133(IO_L34N_GCLK18_0) ; port IO_HDR1.IO11
IO12: U1#1.134(IO_L34P_GCLK19_0) ; port IO_HDR2.IO12
IO13: U1#1.137(IO_L4N_0) ; port IO_HDR2.IO13
IO14: U1#1.138(IO_L4P_0) ; port IO_HDR2.IO14
IO15: U1#1.139(IO_L3N_0) ; port IO_HDR2.IO15
IO16: U1#1.140(IO_L3P_0) ; port IO_HDR2.IO16
IO17: U1#1.141(IO_L2N_0) ; port IO_HDR2.IO17
IO18: U1#1.142(IO_L2P_0) ; port IO_HDR2.IO18
IO19: U1#1.143(IO_L1N_VREF_0) ; port IO_HDR2.IO19
IO20: U1#1.144(IO_L1P_HSWAPEN_0) ; port IO_HDR2.IO20
IO21: U1#1.1(IO_L83N_VREF_3) ; port IO_HDR2.IO21
IO22: U1#1.2(IO_L83P_3) ; port IO_HDR2.IO22
IO23: U1#1.5(IO_L52N_3) ; port IO_HDR2.IO23
IO24: U1#2.45(IO_L49N_D4_2) ; port IO_HDR3.IO24
IO25: U1#2.44(IO_L62P_D5_2) ; port IO_HDR3.IO25
IO26: U1#2.43(IO_L62N_D6_2) ; port IO_HDR3.IO26
IO27: U1#2.41(IO_L64P_D8_2) ; port IO_HDR3.IO27
IO28: U1#2.40(IO_L64N_D9_2) ; port IO_HDR3.IO28
IO29: U1#1.34(IO_L1N_VREF_3) ; port IO_HDR3.IO29
IO30: U1#1.35(IO_L1P_3) ; port IO_HDR3.IO30
IO31: port IO_HDR3.IO31
IO32: port IO_HDR3.IO32
IO33: port IO_HDR3.IO33
IO34: port IO_HDR3.IO34
IO35: port IO_HDR3.IO35
IO36: port IO_HDR4.IO36
IO37: port IO_HDR4.IO37
IO38: port IO_HDR4.IO38
IO39: port IO_HDR4.IO39
IO40: port IO_HDR4.IO40
IO41: port IO_HDR4.IO41
IO42: port IO_HDR4.IO42
IO43: port IO_HDR4.IO43
IO44: port IO_HDR4.IO44
IO45: port IO_HDR4.IO45
IO46: port IO_HDR4.IO46
IO47: port IO_HDR4.IO47
M0: R2.1 U1#2.69(IO_L1N_M0_CMPMISO_2)
M1: R4.2 U1#2.60(IO_L13P_M1_2)
MISO_FPGA: U1#2.65(IO_L3P_D0_DIN_MISO_MISO1_2) ; port SPI_CONFIG_FPGA.MISO_FPGA
MOSI_FPGA: U1#2.66(IO_L2N_CMPMOSI_2) ; port SPI_CONFIG_FPGA.MOSI_FPGA
MUX_SELx: U1#2.58(IO_L14P_D11_2) ; port VXA.MUX_SELx
PROGRAM_Bx: R21.1 U1#1.37(PROGRAM_B_2) ; port VXA.PROGRAM_Bx
REF_CLK: U1#2.51(IO_L31P_GCLK31_D14_2)
RESET_N: U1#1.131(IO_L35N_GCLK16_0) ; port RESET_N
SOFT_TCK: R10.1 ; port SOFT_JTAG.SOFT_TCK
SOFT_TDI: R11.1 ; port SOFT_JTAG.SOFT_TDI
SOFT_TDO: R12.1 ; port SOFT_JTAG.SOFT_TDO
SOFT_TMS: R9.1 ; port SOFT_JTAG.SOFT_TMS
SRAM0_A0: U1#1.16(IO_L43N_GCLK22_IRDY2_3)
SRAM0_A1: U1#1.21(IO_L42N_GCLK24_3)
SRAM0_A2: U1#1.24(IO_L41P_GCLK27_3)
SRAM0_A3: U1#1.17(IO_L43P_GCLK23_3)
SRAM0_A4: U1#1.23(IO_L41N_GCLK26_3)
SRAM0_A5: U1#1.15(IO_L44P_GCLK21_3)
SRAM0_A6: U1#1.22(IO_L42P_GCLK25_TRDY2_3)
SRAM0_A7: U1#1.33(IO_L2P_3)
SRAM0_A8: U1#1.95(IO_L40P_GCLK11_1)
SRAM0_A9: U1#1.93(IO_L41P_GCLK9_IRDY1_1)
SRAM0_A10: U1#1.88(IO_L42P_GCLK7_1)
SRAM0_A11: U1#1.84(IO_L43N_GCLK4_1)
SRAM0_A12: U1#1.92(IO_L41N_GCLK8_1)
SRAM0_A13: U1#1.87(IO_L42N_GCLK6_TRDY1_1)
SRAM0_A14: U1#1.94(IO_L40N_GCLK10_1)
SRAM0_A15: U1#1.85(IO_L43P_GCLK5_1)
SRAM0_A16: U1#1.78(IO_L47N_1)
SRAM0_A17: U1#1.6(IO_L52P_3)
SRAM0_CS_N: U1#1.26(IO_L37N_3) ; port SRAM0.SRAM0_CS_N
SRAM0_D0: U1#1.27(IO_L37P_3)
SRAM0_D1: U1#1.29(IO_L36N_3)
SRAM0_D2: U1#1.30(IO_L36P_3)
SRAM0_D3: U1#1.32(IO_L2N_3)
SRAM0_D4: U1#1.79(IO_L47P_1)
SRAM0_D5: U1#1.81(IO_L46P_1)
SRAM0_D6: U1#1.80(IO_L46N_1)
SRAM0_D7: U1#1.82(IO_L45N_1)
SRAM0_D8: U1#1.10(IO_L50P_3)
SRAM0_D9: U1#1.8(IO_L51P_3)
SRAM0_D10: U1#1.9(IO_L50N_3)
SRAM0_D11: U1#1.7(IO_L51N_3)
SRAM0_D12: U1#1.100(IO_L33P_1)
SRAM0_D13: U1#1.98(IO_L34P_1)
SRAM0_D14: U1#1.99(IO_L33N_1)
SRAM0_D15: U1#1.97(IO_L34N_1)
SRAM0_HBE_N: U1#1.12(IO_L49P_3) ; port SRAM0.SRAM0_HBE_N
SRAM0_LBE_N: U1#1.11(IO_L49N_3) ; port SRAM0.SRAM0_LBE_N
SRAM0_OE_N: U1#1.14(IO_L44N_GCLK20_3) ; port SRAM0.SRAM0_OE_N
SRAM0_WE_N: U1#1.83(IO_L45P_1) ; port SRAM0.SRAM0_WE_N

Not connected (* = marked no-connect by the designer): U1#1 72(CMPCS_B_2)*; U1#2 46(IO_L49P_D3_2) 47(IO_L48N_RDWR_B_VREF_2) 50(IO_L31N_GCLK30_D15_2)

### Buses and harness runs
bus SRAM0_A[17..0]
bus SRAM0_D[15..0]

### Notes on the sheet
- (near R29) 4 x 33R
- (in symbol CMP-0067-00454-1, part A) BANK 0
- (in symbol CMP-0067-00454-1, part B) BANK 1
- (in symbol CMP-0067-00454-1, part C) BANK 2
- (in symbol CMP-0067-00454-1, part D) BANK 3

### Library data of the parts
R1 R3 = 0402 (1005 Metric) 1/16 W 100R 1 Thick Film Chip Resistor: Manufacturer_PN: CR0603-FX-1000ELFDKR-ND; Power: 1/16 W; Case-Metric: 1005; Case-EIA: 0402; Temp Coefficient ppm/°C: ±100; Tolerance %: 1%; Value (Ohms): 100; Technology: SMT; Manufacturer Part Number: CR0603-FX-1000ELFDKR-ND
R2 R5 R6 R17-R21 = 0402 (1005 Metric) 1/16 W 4K7 1 Thick Film Chip Resistor: as R30 on sheet Arduino FPGA Top-Level Interface; Technology: SMT; Manufacturer Part Number: CR0402-FX-4701GLFDKR-ND
R4 = 0402 (1005 Metric) 1/16 W 1K 1 Thick Film Chip Resistor: Manufacturer_PN: CR0402-FX-1001GLFDKR-ND; Power: 1/16 W; Case-Metric: 1005; Case-EIA: 0402; Temp Coefficient ppm/°C: ±100; Tolerance %: 1%; Value (Ohms): 1000; Technology: SMT; Manufacturer Part Number: CR0402-FX-1001GLFDKR-ND
R9-R12 R24 R26 R27 R29 = 0402 (1005 Metric) 1/16 W 33R 1 Thick Film Chip Resistor: Manufacturer_PN: RC1005F330CS; Power: 1/16 W; Case-EIA: 0402; Case-Metric: 1005; Temp Coefficient ppm/°C: ±100; Tolerance %: 1%; Value (Ohms): 33; Technology: SMT; Manufacturer Part Number: RC1005F330CS
  R24 R26 R27 R29: Value: 33R
R22 = 0402 (1005 Metric) 1/16 W 330R 1 Thick Film Chip Resistor: Manufacturer_PN: RC1005F331CS; Case-EIA: 0402; Case-Metric: 1005; Power: 1/16 W; Temp Coefficient ppm/°C: ±100; Tolerance %: 1%; Value (Ohms): 330; Technology: SMT; Manufacturer Part Number: RC1005F331CS
U1#1 U1#2 = CMP-0067-00454-1: Spartan-6 LX 1.2V FPGA, 102 User I/Os, 144-Pin TQFP (0.5mm Pitch), Speed Grade 2, Commercial Grade, Pb-Free; PackageVersion: ver1.2, Jun-2004; DatasheetVersion: ver1.6, Nov-2010; PackageDescription: 144-Pin Thin Quad Flat Pack (TQG144) - Pb-Free; PackageReference: TQG144; Code_JEDEC: MS-026-BFB; Manufacturer_PN: XC6SLX9-2TQG144C; Manufacturer Part Number: XC6SLX9-2TQG144C

## Sheet FPGA - Decoupling.SchDoc
size A4
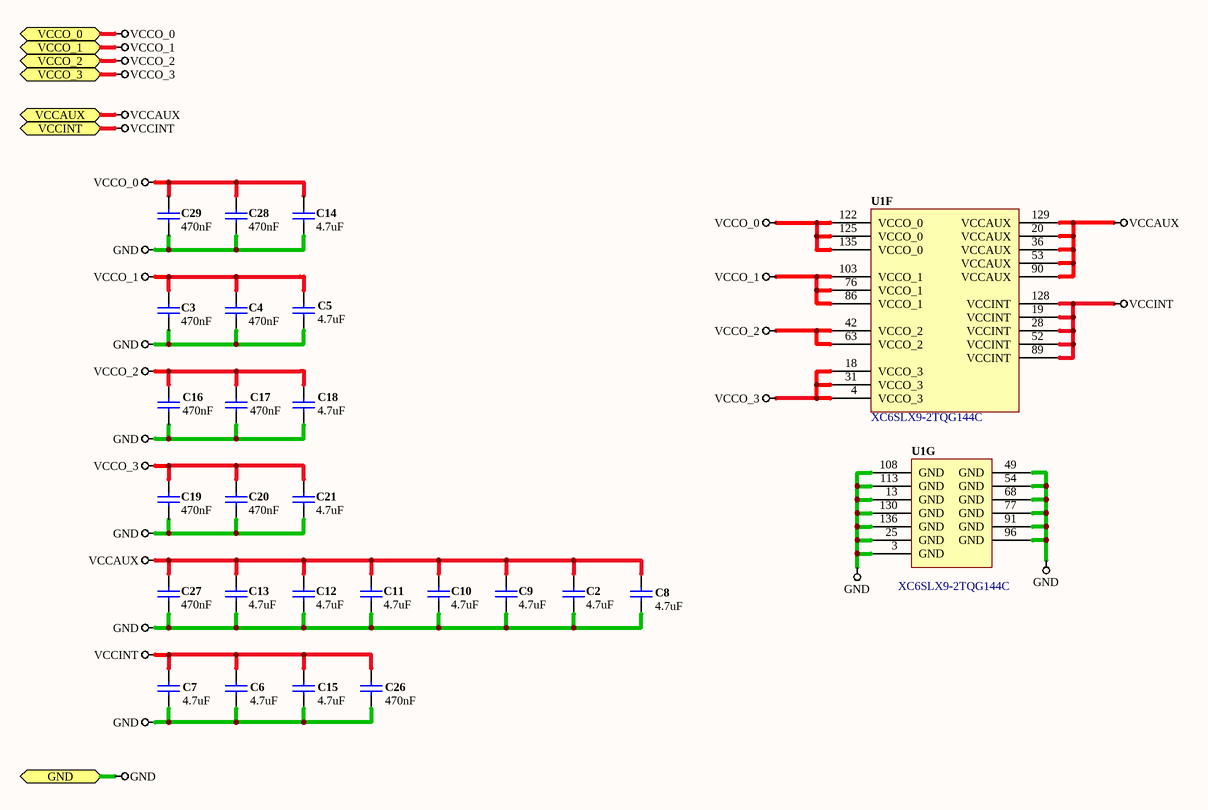
[diagram p4: FPGA - Decoupling.SchDoc]

### Parts
(Parts that share a designator on the sheet are numbered #1, #2 ... from top to bottom, then left to right.)
C2  value 4.7uF  [CAPC0603(1608)55_L]  (hidden comment: CAP 4.7uF 10V 0603(1608))
C3  value 470nF  [CAPC0402(1005)60_L]  (hidden comment: CAP 470nF 10V 0402(1005))
C4  value 470nF  [CAPC0402(1005)60_L]  (hidden comment: CAP 470nF 10V 0402(1005))
C5  value 4.7uF  [CAPC0603(1608)55_L]  (hidden comment: CAP 4.7uF 10V 0603(1608))
C6  value 4.7uF  [CAPC0603(1608)55_L]  (hidden comment: CAP 4.7uF 10V 0603(1608))
C7  value 4.7uF  [CAPC0603(1608)55_L]  (hidden comment: CAP 4.7uF 10V 0603(1608))
C8  value 4.7uF  [CAPC0603(1608)55_L]  (hidden comment: CAP 4.7uF 10V 0603(1608))
C9  value 4.7uF  [CAPC0603(1608)55_L]  (hidden comment: CAP 4.7uF 10V 0603(1608))
C10  value 4.7uF  [CAPC0603(1608)55_L]  (hidden comment: CAP 4.7uF 10V 0603(1608))
C11  value 4.7uF  [CAPC0603(1608)55_L]  (hidden comment: CAP 4.7uF 10V 0603(1608))
C12  value 4.7uF  [CAPC0603(1608)55_L]  (hidden comment: CAP 4.7uF 10V 0603(1608))
C13  value 4.7uF  [CAPC0603(1608)55_L]  (hidden comment: CAP 4.7uF 10V 0603(1608))
C14  value 4.7uF  [CAPC0603(1608)55_L]  (hidden comment: CAP 4.7uF 10V 0603(1608))
C15  value 4.7uF  [CAPC0603(1608)55_L]  (hidden comment: CAP 4.7uF 10V 0603(1608))
C16  value 470nF  [CAPC0402(1005)60_L]  (hidden comment: CAP 470nF 10V 0402(1005))
C17  value 470nF  [CAPC0402(1005)60_L]  (hidden comment: CAP 470nF 10V 0402(1005))
C18  value 4.7uF  [CAPC0603(1608)55_L]  (hidden comment: CAP 4.7uF 10V 0603(1608))
C19  value 470nF  [CAPC0402(1005)60_L]  (hidden comment: CAP 470nF 10V 0402(1005))
C20  value 470nF  [CAPC0402(1005)60_L]  (hidden comment: CAP 470nF 10V 0402(1005))
C21  value 4.7uF  [CAPC0603(1608)55_L]  (hidden comment: CAP 4.7uF 10V 0603(1608))
C26  value 470nF  [CAPC0402(1005)60_L]  (hidden comment: CAP 470nF 10V 0402(1005))
C27  value 470nF  [CAPC0402(1005)60_L]  (hidden comment: CAP 470nF 10V 0402(1005))
C28  value 470nF  [CAPC0402(1005)60_L]  (hidden comment: CAP 470nF 10V 0402(1005))
C29  value 470nF  [CAPC0402(1005)60_L]  (hidden comment: CAP 470nF 10V 0402(1005))
U1#1  XC6SLX9-2TQG144C  [TQG144_N]  (parts F,G of 7)

### Ports
GND, VCCAUX, VCCINT, VCCO_0, VCCO_1, VCCO_2, VCCO_3

### Nets
GND: C2.2 C3.1 C4.1 C5.2 C6.2 C7.2 C8.2 C9.2 C10.2 C11.2 C12.2 C13.2 C14.1 C15.2 C16.1 C17.1 C18.1 C19.1 C20.1 C21.1 C26.2 C27.2 C28.1 C29.1 U1#1.3(GND) U1#1.13(GND) U1#1.25(GND) U1#1.49(GND) U1#1.54(GND) U1#1.68(GND) U1#1.77(GND) U1#1.91(GND) U1#1.96(GND) U1#1.108(GND) U1#1.113(GND) U1#1.130(GND) U1#1.136(GND) ; port GND
VCCAUX: C2.1 C3.2 C4.2 C5.1 C8.1 C9.1 C10.1 C11.1 C12.1 C13.1 C14.2 C16.2 C17.2 C18.2 C19.2 C20.2 C21.2 C27.1 C28.2 C29.2 U1#1.4(VCCO_3) U1#1.18(VCCO_3) U1#1.20(VCCAUX) U1#1.31(VCCO_3) U1#1.36(VCCAUX) U1#1.42(VCCO_2) U1#1.53(VCCAUX) U1#1.63(VCCO_2) U1#1.76(VCCO_1) U1#1.86(VCCO_1) U1#1.90(VCCAUX) U1#1.103(VCCO_1) U1#1.122(VCCO_0) U1#1.125(VCCO_0) U1#1.129(VCCAUX) U1#1.135(VCCO_0) ; port VCCO_0, port VCCO_3, port VCCO_1, port VCCO_2, port VCCAUX  [also labelled VCCO_0, VCCO_1, VCCO_2, VCCO_3]  [project net 3V3]
VCCINT: C6.1 C7.1 C15.1 C26.1 U1#1.19(VCCINT) U1#1.28(VCCINT) U1#1.52(VCCINT) U1#1.89(VCCINT) U1#1.128(VCCINT) ; port VCCINT  [project net 1V2]

### Library data of the parts
C2 C5-C15 C18 C21 = CAP 4.7uF 10V ±10% 0603 (1608 Metric) Thickness 0.55mm SMD: Manufacturer_PN: CC0603KRX5R6BB475; Case-Metric: 1608; Case-EIA: 0603; Tolerance: ±10%; Rated Voltage: 10 V; Technology: SMT; Max Thickness: 0.55 mm; Manufacturer Part Number: CC0603KRX5R6BB475
C3 C4 C16 C17 C19 C20 C26-C29 = CAP 470nF 10V ±10% 0402 (1005 Metric) Thickness 0.6mm SMD: Manufacturer_PN: LMK105BJ474KV-F; Case-Metric: 1005; Case-EIA: 0402; Tolerance: ±10%; Rated Voltage: 10 V; Max Thickness: 0.6 mm; Technology: SMT; Manufacturer Part Number: LMK105BJ474KV-F
U1#1 = CMP-0067-00454-1: as U1#1 on sheet FPGA - XC6SLX9-2TQG144C; PackageVersion: ver1.2, Jun-2004; DatasheetVersion: ver1.6, Nov-2010; PackageDescription: 144-Pin Thin Quad Flat Pack (TQG144) - Pb-Free; PackageReference: TQG144; Code_JEDEC: MS-026-BFB; Manufacturer_PN: XC6SLX9-2TQG144C; Manufacturer Part Number: XC6SLX9-2TQG144C

## Sheet Arduino FPGA SPI MUX.SchDoc
size A4
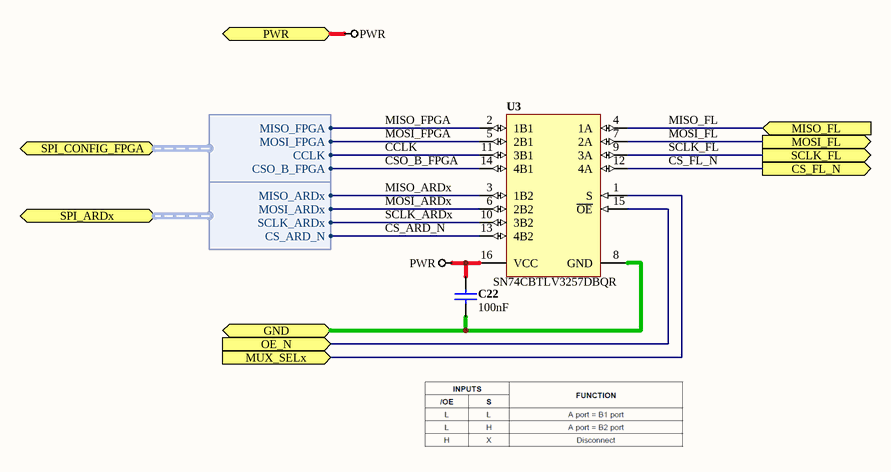
[diagram p5: Arduino FPGA SPI MUX.SchDoc]

### Parts
C22  value 100nF  [CAPC0402(1005)60_L]  (hidden comment: CAP 100nF 16V 0402(1005))
U3  SN74CBTLV3257DBQR  [TI-DBQ16_N]

### Ports
CS_FL_N (out), GND, MISO_FL (in), MOSI_FL (out), MUX_SELx (in), OE_N (in), PWR, SCLK_FL (out), SPI_ARDx (harness SPI_ARDx), SPI_CONFIG_FPGA (harness SPI_CONFIG_FPGA)

### Harnesses
SPI_CONFIG_FPGA: CSO_B_FPGA, CCLK, MISO_FPGA, MOSI_FPGA
SPI_ARDx: MISO_ARDx, MOSI_ARDx, SCLK_ARDx, CS_ARD_N

### Nets
GND: C22.2 U3.8(GND) U3.15(~{OE}) ; port OE_N, port GND
PWR: C22.1 U3.16(VCC) ; port PWR  [project net 3V3]
CCLK: U3.11(3B1) ; port SPI_CONFIG_FPGA.CCLK
CS_ARD_N: U3.13(4B2) ; port SPI_ARDx.CS_ARD_N
CS_FL_N: U3.12(4A) ; port CS_FL_N
CSO_B_FPGA: U3.14(4B1) ; port SPI_CONFIG_FPGA.CSO_B_FPGA
MISO_ARDx: U3.3(1B2) ; port SPI_ARDx.MISO_ARDx
MISO_FL: U3.4(1A) ; port MISO_FL
MISO_FPGA: U3.2(1B1) ; port SPI_CONFIG_FPGA.MISO_FPGA
MOSI_ARDx: U3.6(2B2) ; port SPI_ARDx.MOSI_ARDx
MOSI_FL: U3.7(2A) ; port MOSI_FL
MOSI_FPGA: U3.5(2B1) ; port SPI_CONFIG_FPGA.MOSI_FPGA
MUX_SELx: U3.1(S) ; port MUX_SELx
SCLK_ARDx: U3.10(3B2) ; port SPI_ARDx.SCLK_ARDx
SCLK_FL: U3.9(3A) ; port SCLK_FL

### Library data of the parts
C22 = CAP 100nF 16V ±10% 0402 (1005 Metric) Thickness 0.6mm SMD: as C101 on sheet Arduino FPGA Design; Max Thickness: 0.6 mm; Rated Voltage: 16 V; Technology: SMT; Manufacturer Part Number: C0402C104K8PACTU
U3 = CMP-0267-00001-1: Low-Voltage 4-Bit 1-Of-2 FET Multiplexer/Demultiplexer, 16-pin SOP (DBQ16); Supply Voltage: 2.3 to 3.6 V; Channel: 4; DatasheetVersion: SCDS040J, 10/2003; Mounting Technology: Surface Mount; PartNumber: SN74CBTLV3257DBQR; ComponentLink3URL: http://www.ti.com/lit/ml/msoi004g/msoi004g.pdf; ComponentLink2Description: Datasheet; ComponentLink1URL: http://www.ti.com/; PackageVersion: 4073301-2/H, 10/2008; ComponentLink1Description: Manufacturer URL; ComponentLink3Description: Package Specification; PackageDescription: 16-Pin Plastic Small Outline, 3.9 x 4.9 mm Body, 0.635 mm Pitch; ComponentLink2URL: http://www.ti.com/lit/ds/symlink/sn74cbtlv3257.pdf; PackageReference: DBQ16; Manufacturer_PN: SN74CBTLV3257DBQR; Manufacturer Part Number: SN74CBTLV3257DBQR

## Sheet SRAM0 - IS61WV12816DBLL-10BLI.SchDoc
size A4
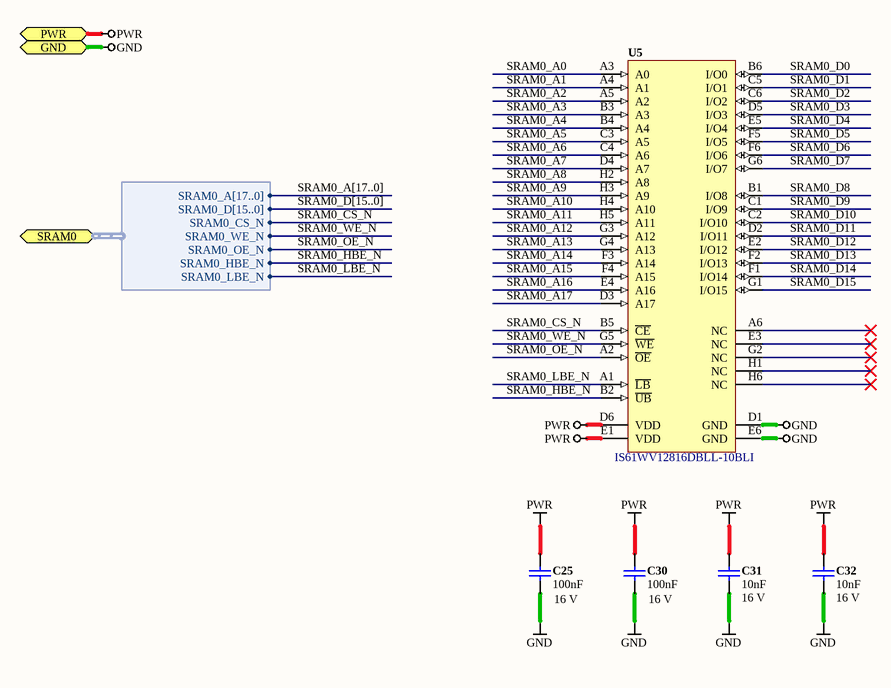
[diagram p6: SRAM0 - IS61WV12816DBLL-10BLI.SchDoc]

### Parts
C25  value 100nF  Rated Voltage: 16 V  [CAPC0402(1005)60_L]  (hidden comment: CAP 100nF 16V 0402(1005))
C30  value 100nF  Rated Voltage: 16 V  [CAPC0402(1005)60_L]  (hidden comment: CAP 100nF 16V 0402(1005))
C31  value 10nF  Rated Voltage: 16 V  [CAPC0402(1005)33_L]  (hidden comment: CAP 10nF 16V 0402(1005))
C32  value 10nF  Rated Voltage: 16 V  [CAPC0402(1005)33_L]  (hidden comment: CAP 10nF 16V 0402(1005))
U5  IS61WV12816DBLL-10BLI  [ISSI-TF-BGA-48-6000X8000DE]

### Ports
GND, PWR, SRAM0 (harness SRAM0)

### Harnesses
SRAM0: SRAM0_A[17..0], SRAM0_D[15..0], SRAM0_CS_N, SRAM0_WE_N, SRAM0_OE_N, SRAM0_HBE_N, SRAM0_LBE_N

### Nets
GND: C25.2 C30.2 C31.2 C32.2 U5.D1(GND) U5.E6(GND) ; port GND
PWR: C25.1 C30.1 C31.1 C32.1 U5.D6(VDD) U5.E1(VDD) ; port PWR  [project net 3V3]
SRAM0_A0: U5.A3(A0)
SRAM0_A1: U5.A4(A1)
SRAM0_A2: U5.A5(A2)
SRAM0_A3: U5.B3(A3)
SRAM0_A4: U5.B4(A4)
SRAM0_A5: U5.C3(A5)
SRAM0_A6: U5.C4(A6)
SRAM0_A7: U5.D4(A7)
SRAM0_A8: U5.H2(A8)
SRAM0_A9: U5.H3(A9)
SRAM0_A10: U5.H4(A10)
SRAM0_A11: U5.H5(A11)
SRAM0_A12: U5.G3(A12)
SRAM0_A13: U5.G4(A13)
SRAM0_A14: U5.F3(A14)
SRAM0_A15: U5.F4(A15)
SRAM0_A16: U5.E4(A16)
SRAM0_A17: U5.D3(A17)
SRAM0_CS_N: U5.B5(~{CE}) ; port SRAM0.SRAM0_CS_N
SRAM0_D0: U5.B6(I/O0)
SRAM0_D1: U5.C5(I/O1)
SRAM0_D2: U5.C6(I/O2)
SRAM0_D3: U5.D5(I/O3)
SRAM0_D4: U5.E5(I/O4)
SRAM0_D5: U5.F5(I/O5)
SRAM0_D6: U5.F6(I/O6)
SRAM0_D7: U5.G6(I/O7)
SRAM0_D8: U5.B1(I/O8)
SRAM0_D9: U5.C1(I/O9)
SRAM0_D10: U5.C2(I/O10)
SRAM0_D11: U5.D2(I/O11)
SRAM0_D12: U5.E2(I/O12)
SRAM0_D13: U5.F2(I/O13)
SRAM0_D14: U5.F1(I/O14)
SRAM0_D15: U5.G1(I/O15)
SRAM0_HBE_N: U5.B2(~{UB}) ; port SRAM0.SRAM0_HBE_N
SRAM0_LBE_N: U5.A1(~{LB}) ; port SRAM0.SRAM0_LBE_N
SRAM0_OE_N: U5.A2(~{OE}) ; port SRAM0.SRAM0_OE_N
SRAM0_WE_N: U5.G5(~{WE}) ; port SRAM0.SRAM0_WE_N

Not connected (* = marked no-connect by the designer): U5 A6(NC)* E3(NC)* G2(NC)* H1(NC)* H6(NC)*

### Buses and harness runs
bus SRAM0_A[17..0]
bus SRAM0_D[15..0]

### Library data of the parts
C25 C30 = CAP 100nF 16V ±10% 0402 (1005 Metric) Thickness 0.6mm SMD: as C101 on sheet Arduino FPGA Design; Max Thickness: 0.6 mm; Technology: SMT; Manufacturer Part Number: C0402C104K8PACTU
C31 C32 = CMP-1034-01875-1: CAP 10nF 16V ±10% 0402 (1005 Metric) Thickness 0.33mm SMD; Manufacturer_PN: GRM155R61C103KA01D; Case-EIA: 0402; Case-Metric: 1005; Max Thickness: 0.33 mm; Tolerance: ±10%; Technology: SMT; Manufacturer Part Number: GRM155R61C103KA01D
U5 = CMP-0513-00111-1: 2 M High Speed Asynchronous CMOS SRAM, 128 K x 16, -40 to 85 degC, 48-Pin BGA (TF-BGA-48), Pb-Free; Manufacturer: Integrated Silicon Solution Inc (ISSI); Speed (ns): 10; Packing: Tray / Tube; Mounting Technology: Surface Mount; DatasheetVersion: Rev. D; PackageReference: TF-BGA-48; ComponentLink2URL: http://www.issi.com/WW/pdf/61-64WV12816DAxx-DBxx.pdf; PartNumber: IS61WV12816DBLL-10BLI; ComponentLink2Description: Datasheet; PackageDescription: 48-Pin 6 x 8 mm TF-BGA, Pitch 0.75 mm; ComponentLink1Description: Manufacturer URL; Code_JEDEC: MO-207; PackageVersion: Rev. C, 08/2008; Organization: 128K x 16; RoHS: Pb-Free; ComponentLink1URL: http://www.issi.com/US/index.shtml; ComponentLink3URL: http://www.issi.com/WW/pdf/61-64WV25616.pdf; ComponentLink3Description: Package Specification; Manufacturer_PN: IS61WV12816DBLL-10BLI; Manufacturer Part Number: IS61WV12816DBLL-10BLI

## Sheet Arduino FPGA Level Translation.SchDoc
size A4
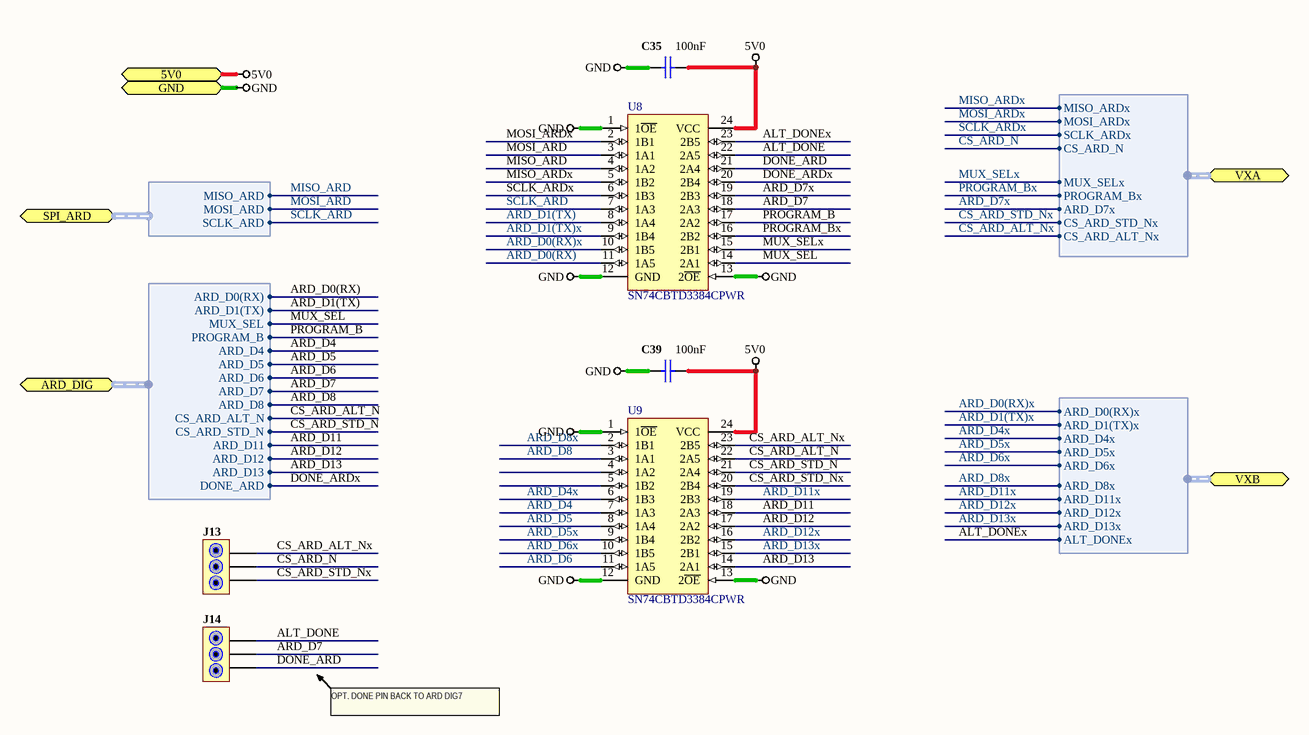
[diagram p7: Arduino FPGA Level Translation.SchDoc]

### Parts
C35  value 100nF  [CAPC0402(1005)60_L]  (hidden comment: CAP 100nF 16V 0402(1005))
C39  value 100nF  [CAPC0402(1005)60_L]  (hidden comment: CAP 100nF 16V 0402(1005))
J13  3-WAY JUMPER  [HDR1X3]  (value not drawn)
J14  3-WAY JUMPER  [HDR1X3]  (value not drawn)
U8  SN74CBTD3384CPWR  [TSOP65P620X120-24N]
U9  SN74CBTD3384CPWR  [TSOP65P620X120-24N]

### Ports
5V0, ARD_DIG (harness ARD_DIG), GND, SPI_ARD (harness SPI_ARD), VXA (harness VXA), VXB (harness VXB)

### Harnesses
SPI_ARD: MISO_ARD, MOSI_ARD, SCLK_ARD
VXB: ARD_D0(RX)x, ARD_D1(TX)x, ARD_D4x, ARD_D5x, ARD_D6x, ARD_D8x, ARD_D11x, ARD_D12x, ARD_D13x, ALT_DONEx
ARD_DIG: ARD_D0(RX), ARD_D1(TX), MUX_SEL, PROGRAM_B, ARD_D4, ARD_D5, ARD_D6, ARD_D7, ARD_D8, CS_ARD_ALT_N, CS_ARD_STD_N, ARD_D11, ARD_D12, ARD_D13, DONE_ARD
VXA: MISO_ARDx, MOSI_ARDx, SCLK_ARDx, CS_ARD_N, MUX_SELx, PROGRAM_Bx, ARD_D7x, CS_ARD_STD_Nx, CS_ARD_ALT_Nx

### Nets
5V0: C35.2 C39.2 U8.24(VCC) U9.24(VCC) ; port 5V0
GND: C35.1 C39.1 U8.1(1~{OE}) U8.12(GND) U8.13(2~{OE}) U9.1(1~{OE}) U9.12(GND) U9.13(2~{OE}) ; port GND
ALT_DONE: J14.3 U8.22(2A5)
ALT_DONEx: U8.23(2B5) ; port VXB.ALT_DONEx
ARD_D0(RX): U8.11(1A5) ; port ARD_DIG.ARD_D0(RX)
ARD_D0(RX)x: U8.10(1B5) ; port VXB.ARD_D0(RX)x
ARD_D1(TX): U8.8(1A4) ; port ARD_DIG.ARD_D1(TX)
ARD_D1(TX)x: U8.9(1B4) ; port VXB.ARD_D1(TX)x
ARD_D4: U9.7(1A3) ; port ARD_DIG.ARD_D4
ARD_D4x: U9.6(1B3) ; port VXB.ARD_D4x
ARD_D5: U9.8(1A4) ; port ARD_DIG.ARD_D5
ARD_D5x: U9.9(1B4) ; port VXB.ARD_D5x
ARD_D6: U9.11(1A5) ; port ARD_DIG.ARD_D6
ARD_D6x: U9.10(1B5) ; port VXB.ARD_D6x
ARD_D7: J14.2 U8.18(2A3) ; port ARD_DIG.ARD_D7
ARD_D7x: U8.19(2B3) ; port VXA.ARD_D7x
ARD_D8: U9.3(1A1) ; port ARD_DIG.ARD_D8
ARD_D8x: U9.2(1B1) ; port VXB.ARD_D8x
ARD_D11: U9.18(2A3) ; port ARD_DIG.ARD_D11
ARD_D11x: U9.19(2B3) ; port VXB.ARD_D11x
ARD_D12: U9.17(2A2) ; port ARD_DIG.ARD_D12
ARD_D12x: U9.16(2B2) ; port VXB.ARD_D12x
ARD_D13: U9.14(2A1) ; port ARD_DIG.ARD_D13
ARD_D13x: U9.15(2B1) ; port VXB.ARD_D13x
CS_ARD_ALT_N: U9.22(2A5) ; port ARD_DIG.CS_ARD_ALT_N
CS_ARD_ALT_Nx: J13.3 U9.23(2B5) ; port VXA.CS_ARD_ALT_Nx
CS_ARD_N: J13.2 ; port VXA.CS_ARD_N
CS_ARD_STD_N: U9.21(2A4) ; port ARD_DIG.CS_ARD_STD_N
CS_ARD_STD_Nx: J13.1 U9.20(2B4) ; port VXA.CS_ARD_STD_Nx
DONE_ARD: J14.1 U8.21(2A4)
DONE_ARDx: U8.20(2B4) ; port ARD_DIG.DONE_ARD
MISO_ARD: U8.4(1A2) ; port SPI_ARD.MISO_ARD
MISO_ARDx: U8.5(1B2) ; port VXA.MISO_ARDx
MOSI_ARD: U8.3(1A1) ; port SPI_ARD.MOSI_ARD
MOSI_ARDx: U8.2(1B1) ; port VXA.MOSI_ARDx
MUX_SEL: U8.14(2A1) ; port ARD_DIG.MUX_SEL
MUX_SELx: U8.15(2B1) ; port VXA.MUX_SELx
PROGRAM_B: U8.17(2A2) ; port ARD_DIG.PROGRAM_B
PROGRAM_Bx: U8.16(2B2) ; port VXA.PROGRAM_Bx
SCLK_ARD: U8.7(1A3) ; port SPI_ARD.SCLK_ARD
SCLK_ARDx: U8.6(1B3) ; port VXA.SCLK_ARDx

Not connected (* = marked no-connect by the designer): U9 4(1A2) 5(1B2)

### Notes on the sheet
- OPT. DONE PIN BACK TO ARD DIG7

### Library data of the parts
C35 C39 = CAP 100nF 16V ±10% 0402 (1005 Metric) Thickness 0.6mm SMD: as C101 on sheet Arduino FPGA Design; Max Thickness: 0.6 mm; Rated Voltage: 16 V; Technology: SMT; Manufacturer Part Number: C0402C104K8PACTU
J13 J14 = 3-WAY JUMPER: 3-Way Jumper - Center Output; Manufacturer_PN: 71417-103HLF; Manufacturer Part Number: 71417-103HLF
U8 U9 = SN74CBTD3384CPWR: 10-BIT FET BUS SWITCH WITH LEVEL SHIFTING; Manufacturer Part Number: SN74CBTD3861PWR; Manufacturer: Texas Instruments; Circuit: 10 x 1:1; Independent Circuits: 1; Voltage Supply Source: Single Supply; Voltage - Supply: 4.5 V ~ 5.5 V; Category: Integrated Circuits (ICs); Supplier: Digi-Key; RoHS: RoHS Compliant; Packaging: Tape & Reel (TR); Type: FET Bus Switch; Current - Output High, Low: -; Operating Temperature: -40°C ~ 85°C; Mounting Type: Surface Mount; Package / Case: 24-TSSOP (0.173", 4.40mm Width); Supplier Device Package: 24-TSSOP; ComponentLink1URL: http://www.ti.com/lit/ds/symlink/sn74cbtd3861.pdf; ComponentLink1Description: http://www.ti.com/lit/ds/symlink/sn74cbtd3861.pdf; Supplier Part Number: 296-6487-2-ND; Manufacturer_PN: SN74CBTD3861PWR

## Sheet Power - 5V0.SchDoc
size A4
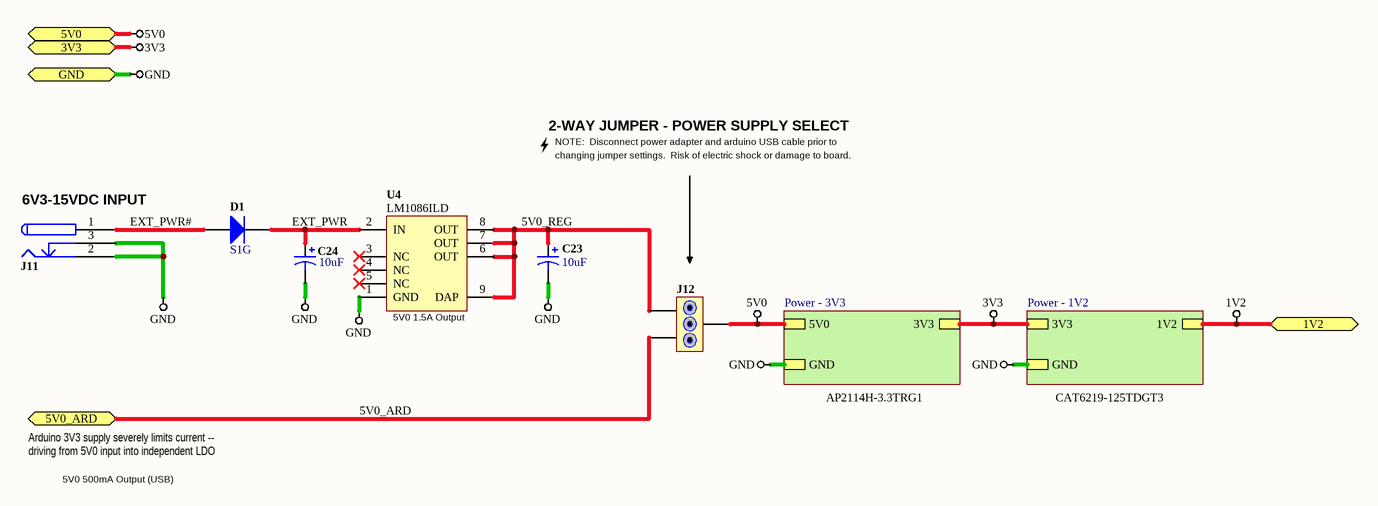
[diagram p8: Power - 5V0.SchDoc]

### Parts
C23  Capacitance: 10uF  [AVX-CAPC3528_V]  (hidden comment: TAJB106K020R)
C24  Capacitance: 10uF  [AVX-CAPC3528_V]  (hidden comment: TAJB106K020R)
D1  S1G  [DO-214AC]
J11  PWR CONNECTOR  [PJ-102AH]  (value not drawn)
J12  3-WAY JUMPER  [HDR1X3]  (value not drawn)
U4  Abbreviated Name: LM1086ILD  [LDC08A]  (hidden comment: LM1086ILD-3.3/NOPB)

### Sub-sheets
Power - 1V2 = Power - 1V2.SchDoc: GND, 3V3, 1V2
Power - 3V3 = Power - 3V3.SchDoc: GND, 5V0, 3V3

### Ports
1V2, 3V3, 5V0, 5V0_ARD, GND

### Nets
1V2: port 1V2, sheet Power - 1V2/1V2
3V3: port 3V3, sheet Power - 3V3/3V3, sheet Power - 1V2/3V3
5V0: J12.2 ; port 5V0, sheet Power - 3V3/5V0
5V0_ARD: J12.3 ; port 5V0_ARD
GND: C23.2 C24.2 J11.2 J11.3 U4.1(GND) ; port GND, sheet Power - 3V3/GND, sheet Power - 1V2/GND
5V0_REG: C23.1 J12.1 U4.6(OUT) U4.7(OUT) U4.8(OUT) U4.9(DAP)
EXT_PWR: C24.1 D1.2 U4.2(IN)
EXT_PWR#: D1.1 J11.1

Not connected (* = marked no-connect by the designer): U4 3(NC)* 4(NC)* 5(NC)*

### Notes on the sheet
- 2-WAY JUMPER - POWER SUPPLY SELECT
- NOTE:  Disconnect power adapter and arduino USB cable prior to
- (near J11) 6V3-15VDC INPUT
- changing jumper settings.  Risk of electric shock or damage to board.
- (near U4) 5V0 1.5A Output
- AP2114H-3.3TRG1
- CAT6219-125TDGT3
- Arduino 3V3 supply severely limits current --
- driving from 5V0 input into independent LDO
- 5V0 500mA Output (USB)

### Library data of the parts
C23 C24 = CMP-0279-00001-1: Capacitor, Tantalum, 10uF 10% 20V MCCT-B (3528); Manufacturer: AVX; Polarity: Polarized; PartNumber: TAJB106K020R; PackageDescription: 2-Pin SMT Capacitor, 3.5 x 2.8 mm Body; ComponentLink1URL: http://www.avx.com/; PackageReference: CAPC3528; ComponentLink2Description: Datasheet; Technology: Tantalum; ComponentLink2URL: http://www.avx.com/docs/Catalogs/taj.pdf; Tolerance: 10%; ComponentLink1Description: Manufacturer URL; Rated Voltage: 20V; DatasheetVersion: Jun-13; Mounting Technology: Surface Mount; Manufacturer_PN: TAJB106K020R; Manufacturer Part Number: TAJB106K020R
D1 = S1G: Fairchild S1G General Purpose Rectifier; Vrrm: 400V; If(AV): 1.0A; Ifsm: 30A; Pd: 1.4W; Trr: 1.8uS; Ct: 6.6pF; Package: DO-214AC; Manufacturer_PN: S1G; Manufacturer Part Number: S1G
J11 = POWER-CONNECTOR-3: Connector, 3 Conductor Power Jack; Manufacturer_PN: CP-102AH-ND; Connector type: POWERJACK 3 HEADER; ClassName: PWR_CONN_5V0; Category: Connector; Mounting Technology: PTH; Pin Count: 3; Manufacturer Part Number: CP-102AH-ND
J12 = 3-WAY JUMPER: as J13 on sheet Arduino FPGA Level Translation; Manufacturer Part Number: 71417-103HLF
U4 = CMP-0062-01489-2: 1.5A Low Dropout Positive Regulators, 8-pin LLP, Pb-Free; Manufacturer: National Semiconductor; PowerWise: N; CompType: LDO IC; PackageTopMarking: NS*UZXYTT*1086I33; ComponentLink1Description: LM1086 Datasheet; RoHS: Y; ComponentLink2URL: http://www.national.com/pf/LM/LM1086.html; PinCount: 8; DatasheetVersion: Jun-2005; ComponentLink2Description: LM1086 Web Page; ComponentLink3URL: http://www.national.com/packaging/folders/ldc08a.html; ComponentLink1URL: http://www.national.com/ds/LM/LM1086.pdf; PackageReference: LDC08A; PackageVersion: revB, Jun-2003; ComponentLink3Description: LDC08A Package Page; PackageDescription: LLP, Plastic, Dual, 4 x 4 x 0.75mm Body, 8 Lead, 0.8mm Pitch; RevisionNote: Component URLs added; Manufacturer_PN: LM1086ILD-3.3/NOPB; Manufacturer Part Number: LM1086ILD-3.3/NOPB

## Sheet Power - 3V3.SchDoc
size A4
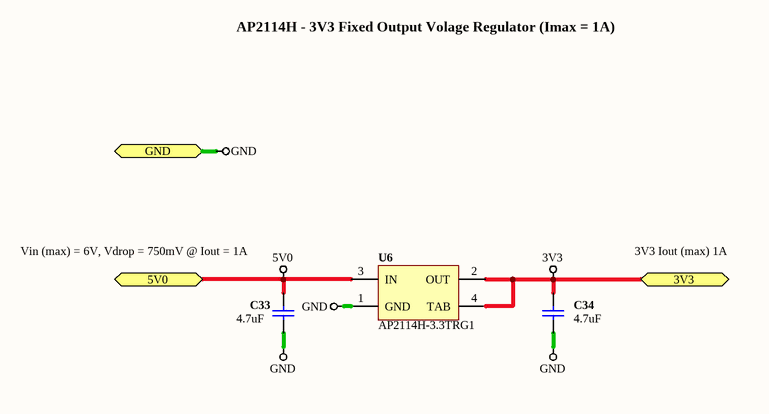
[diagram p9: Power - 3V3.SchDoc]

### Parts
C33  value 4.7uF  [CAPC0603(1608)55_L]  (hidden comment: CAP 4.7uF 10V 0603(1608))
C34  value 4.7uF  [CAPC0603(1608)55_L]  (hidden comment: CAP 4.7uF 10V 0603(1608))
U6  AP2114H-3.3TRG1  [SOT230P700X180-4L]

### Ports
3V3, 5V0, GND

### Nets
3V3: C34.1 U6.2(OUT) U6.4(TAB) ; port 3V3
5V0: C33.1 U6.3(IN) ; port 5V0
GND: C33.2 C34.2 U6.1(GND) ; port GND

### Notes on the sheet
- AP2114H - 3V3 Fixed Output Volage Regulator (Imax = 1A)
- (near C33) Vin (max) = 6V, Vdrop = 750mV @ Iout = 1A
- 3V3 Iout (max) 1A

### Library data of the parts
C33 C34 = CAP 4.7uF 10V ±10% 0603 (1608 Metric) Thickness 0.55mm SMD: as C2 on sheet FPGA - Decoupling; Rated Voltage: 10 V; Technology: SMT; Max Thickness: 0.55 mm; Manufacturer Part Number: CC0603KRX5R6BB475
U6 = AP2114H-3.3TRG1: AP2114, 1A Low Dropout Positive Fixed 3V3 Regulator; Max Input Voltage: 6V; Max Output Voltage: 3.34V; Min Input Voltage: -0.3V; Min Output Voltage: 3.25V; Supply Voltage: 5V; Max Output Current: 1A; Mounting Technology: Surface Mount; Status: Unreleased; Temperature Range: -40 - 125 degC; Category: IC-Power; Manufacturer_PN: AP2114H-3.3TRG1; Manufacturer Part Number: AP2114H-3.3TRG1